# EAGLE design BPS6001 Arcade Shield (EAGLE 6.5.0)

## Sheet 1 of 6
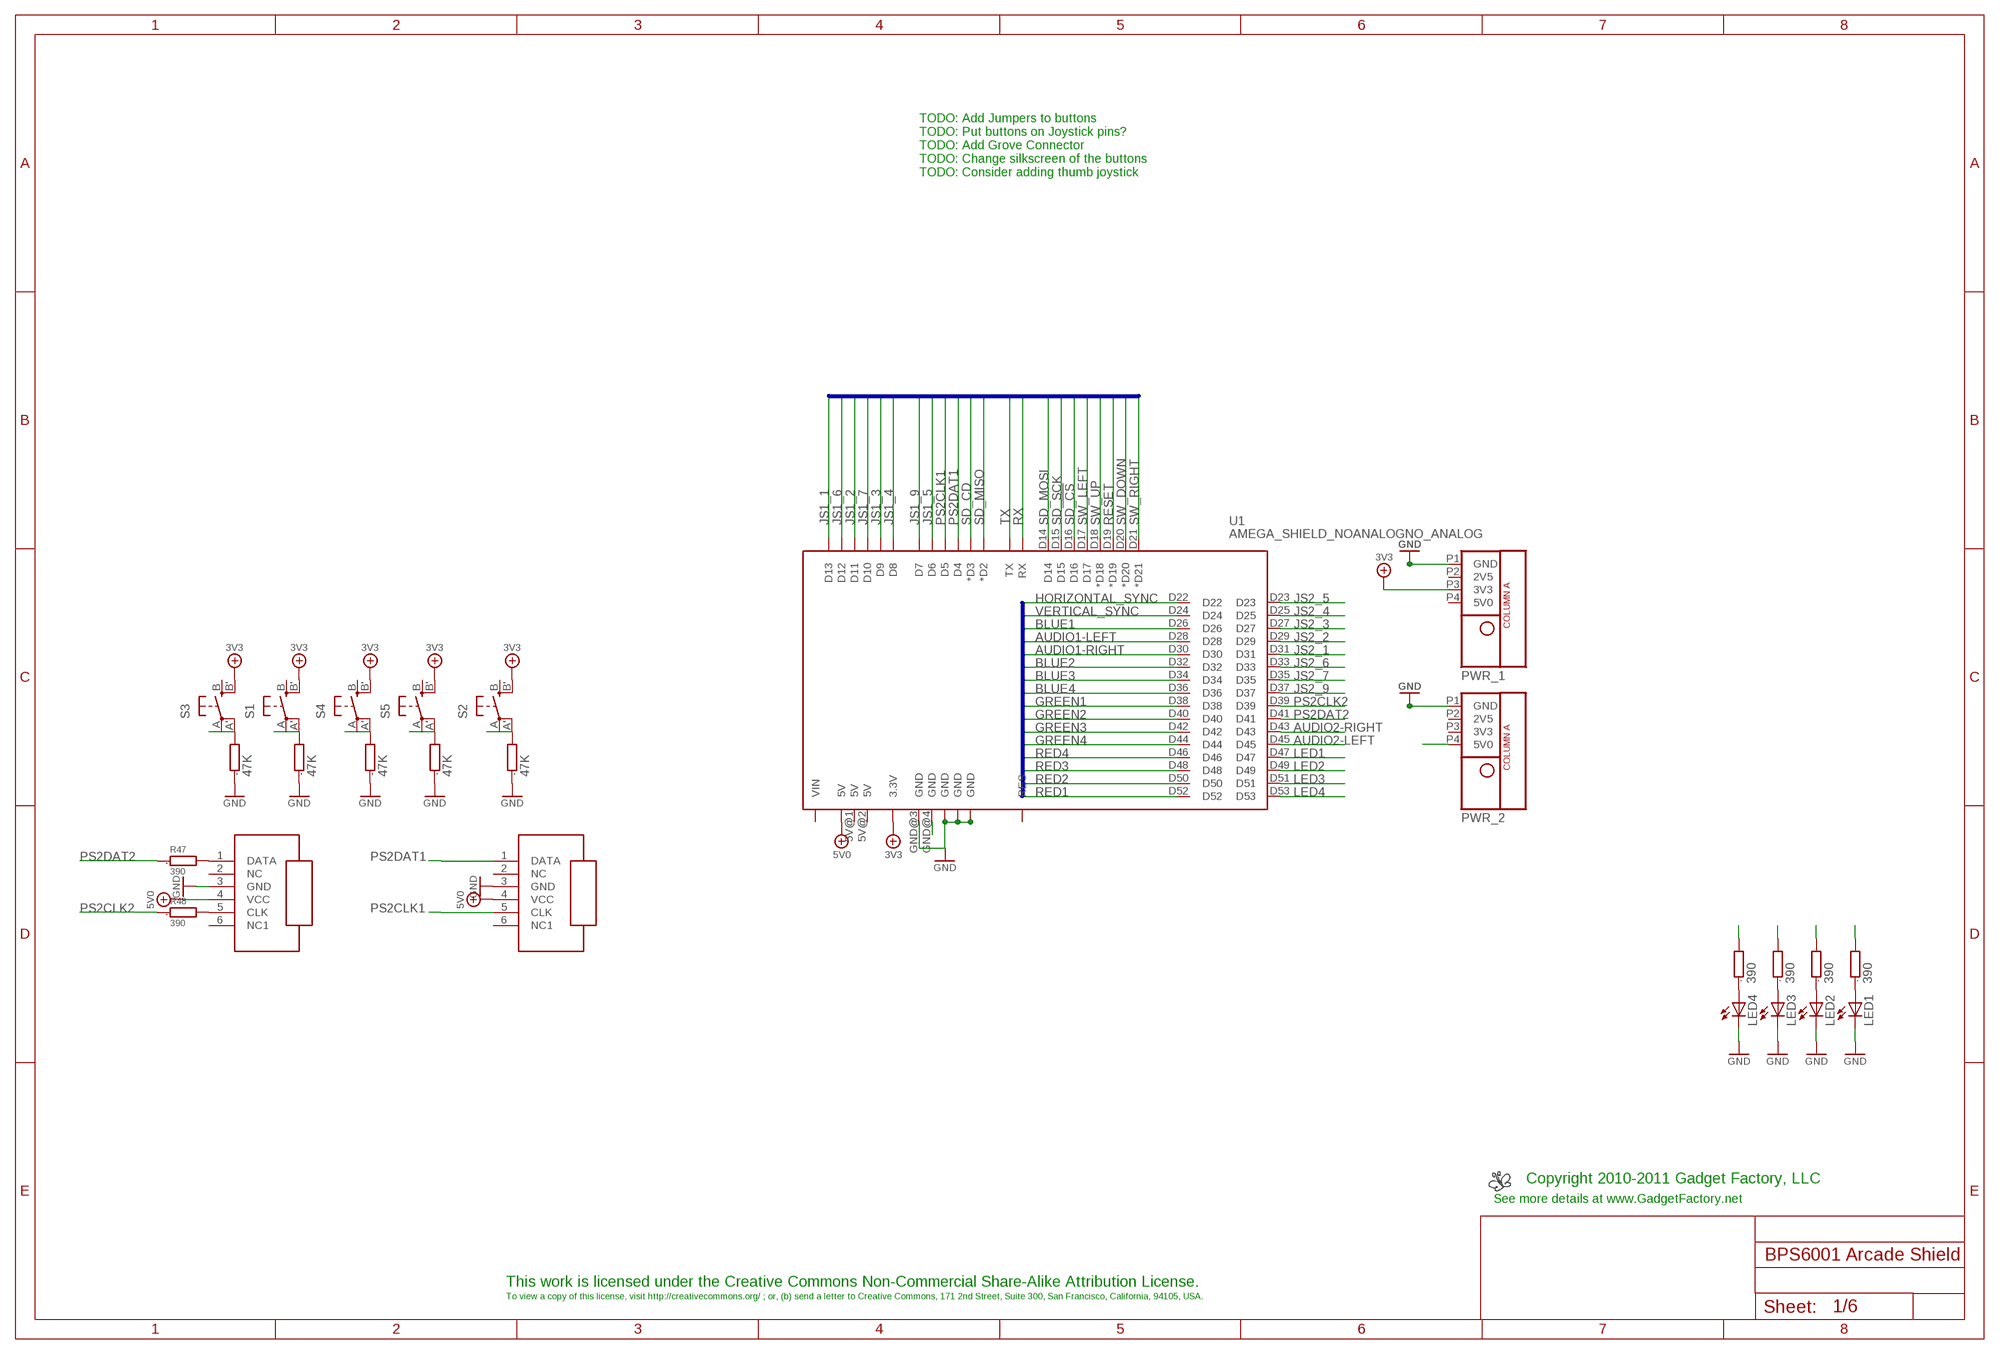
[diagram p0: schematic, sheet 1]

### Parts
LED1  LEDCHIPLED_0603  [CHIPLED_0603]
LED2  LEDCHIPLED_0603  [CHIPLED_0603]
LED3  LEDCHIPLED_0603  [CHIPLED_0603]
LED4  LEDCHIPLED_0603  [CHIPLED_0603]
LOGO1  BUTTERFLY_LOGO  [BUTTERFLY_LOGO]
PS2_A  CON_PS/2  [PS/2]
PS2_B  CON_PS/2  [PS/2]
PWR_1  POWER_ONLYNOTEXT  [POWER_NO_TEXT]
PWR_2  POWER_ONLYNOTEXT  [POWER_NO_TEXT]
R9  47K  R0603  [0603]
R10  47K  R0603  [0603]
R11  47K  R0603  [0603]
R17  47K  R0603  [0603]
R18  47K  R0603  [0603]
R26  390  R0603  [0603]
R27  390  R0603  [0603]
R43  390  R0603  [0603]
R44  390  R0603  [0603]
R47  390  R0603  [0603]
R48  390  R0603  [0603]
S1  EVQQ2  [EVQ-Q2]
S2  EVQQ2  [EVQ-Q2]
S3  EVQQ2  [EVQ-Q2]
S4  EVQQ2  [EVQ-Q2]
S5  EVQQ2  [EVQ-Q2]
U1  AMEGA_SHIELD_NOANALOGNO_ANALOG  [AMEGA_SHIELD_NOANALOG]

### Nets
3V3: S1.B'(S1) S2.B'(S1) S3.B'(S1) S4.B'(S1) S5.B'(S1) U1.3.3V ; also sheet 2,3,5
5V0: PS2_A.4(VCC) U1.5V@0(5V)
5V0_PS2: PS2_B.4(VCC) PWR_2.P4(5V0) ; supply symbol labelled 5V0
AUDIO1-LEFT: U1.D28 ; also sheet 4
AUDIO1-RIGHT: U1.D30 ; also sheet 4
AUDIO2-LEFT: U1.D45 ; also sheet 4
AUDIO2-RIGHT: U1.D43 ; also sheet 4
BLUE1: U1.D26 ; also sheet 6
BLUE2: U1.D32 ; also sheet 6
BLUE3: U1.D34 ; also sheet 6
BLUE4: U1.D36 ; also sheet 6
GND: PS2_A.3(GND) R9.1 R10.1 R11.1 R17.1 R18.1 U1.GND@0(GND) U1.GND@1(GND) U1.GND@2(GND) U1.GND@3(GND) ; also sheet 2,3,4,5,6
GREEN1: U1.D38 ; also sheet 6
GREEN2: U1.D40 ; also sheet 6
GREEN3: U1.D42 ; also sheet 6
GREEN4: U1.D44 ; also sheet 6
HORIZONTAL_SYNC: U1.D22 ; also sheet 6
JOY_3V3: PWR_1.P3(3V3) ; supply symbol labelled 3V3 ; also sheet 3
JOY_GND: LED1.C LED2.C LED3.C LED4.C PS2_B.3(GND) PWR_1.P1(GND) PWR_2.P1(GND) U1.GND@4(GND) ; supply symbol labelled GND ; also sheet 3,4
JS1_1: U1.D13 ; also sheet 3
JS1_2: U1.D11 ; also sheet 3
JS1_3: U1.D9 ; also sheet 3
JS1_4: U1.D8 ; also sheet 3
JS1_5: U1.D6 ; also sheet 3
JS1_6: U1.D12 ; also sheet 3
JS1_7: U1.D10 ; also sheet 3
JS1_9: U1.D7 ; also sheet 3
JS2_1: U1.D31 ; also sheet 3
JS2_2: U1.D29 ; also sheet 3
JS2_3: U1.D27 ; also sheet 3
JS2_4: U1.D25 ; also sheet 3
JS2_5: U1.D23 ; also sheet 3
JS2_6: U1.D33 ; also sheet 3
JS2_7: U1.D35 ; also sheet 3
JS2_9: U1.D37 ; also sheet 3
LED1: R26.2 U1.D47
LED2: R27.2 U1.D49
LED3: R43.2 U1.D51
LED4: R44.2 U1.D53
N$3: LED4.A R44.1
N$9: LED3.A R43.1
N$10: LED2.A R27.1
N$11: LED1.A R26.1
N$16: PS2_B.1(DATA) R47.2
N$17: PS2_B.5(CLK) R48.2
PS2CLK1: PS2_A.5(CLK) U1.D5
PS2CLK2: R48.1 U1.D39
PS2DAT1: PS2_A.1(DATA) U1.D4
PS2DAT2: R47.1 U1.D41
RED1: U1.D52 ; also sheet 6
RED2: U1.D50 ; also sheet 6
RED3: U1.D48 ; also sheet 6
RED4: U1.D46 ; also sheet 6
RESET: R11.2 S2.A'(P1) S2.A(P) U1.D19(*D19)
RX: U1.RX ; also sheet 5
SD_!CS: U1.D16 ; also sheet 2
SD_CD: U1.D3(*D3) ; also sheet 2
SD_MISO: U1.D2(*D2) ; also sheet 2
SD_MOSI: U1.D14 ; also sheet 2
SD_SCK: U1.D15 ; also sheet 2
SW_DOWN: R17.2 S4.A'(P1) S4.A(P) U1.D20(*D20)
SW_LEFT: R9.2 S3.A'(P1) S3.A(P) U1.D17
SW_RIGHT: R18.2 S5.A'(P1) S5.A(P) U1.D21(*D21)
SW_UP: R10.2 S1.A'(P1) S1.A(P) U1.D18(*D18)
TX: U1.TX ; also sheet 5
VERTICAL_SYNC: U1.D24 ; also sheet 6
Unconnected: PS2_A.2(NC) PS2_A.6(NC1) PS2_B.2(NC) PS2_B.6(NC1) PWR_1.P2(2V5) PWR_1.P4(5V0) PWR_2.P2(2V5) PWR_2.P3(3V3) S1.B(S) S2.B(S) S3.B(S) S4.B(S) S5.B(S) U1.5V@1(5V) U1.5V@2(5V) U1.RES U1.VIN

### Buses
LED[1..4],JS1_[1..9],JS2_[1..9],AUDIO-,AUDIO+,PS2CLK1,PS2CLK2,PS2DAT1,PS2DAT2,RED[1..4],GREEN[1..4],BLUE[1..4],SW[1..4],RESET,HORIZONTAL_SYNC

### Notes on the sheet
- TODO: Add Jumpers to buttons
  TODO: Put buttons on Joystick pins?
  TODO: Add Grove Connector
  TODO: Change silkscreen of the buttons
  TODO: Consider adding thumb joystick
- Copyright 2010-2011 Gadget Factory, LLC
- See more details at www.GadgetFactory.net
- This work is licensed under the Creative Commons Non-Commercial Share-Alike Attribution License.
- To view a copy of this license, visit http://creativecommons.org/ ; or, (b) send a letter to Creative Commons, 171 2nd Street, Suite 300, San Francisco, California, 94105, USA.

## Sheet 2 of 6: SD Card
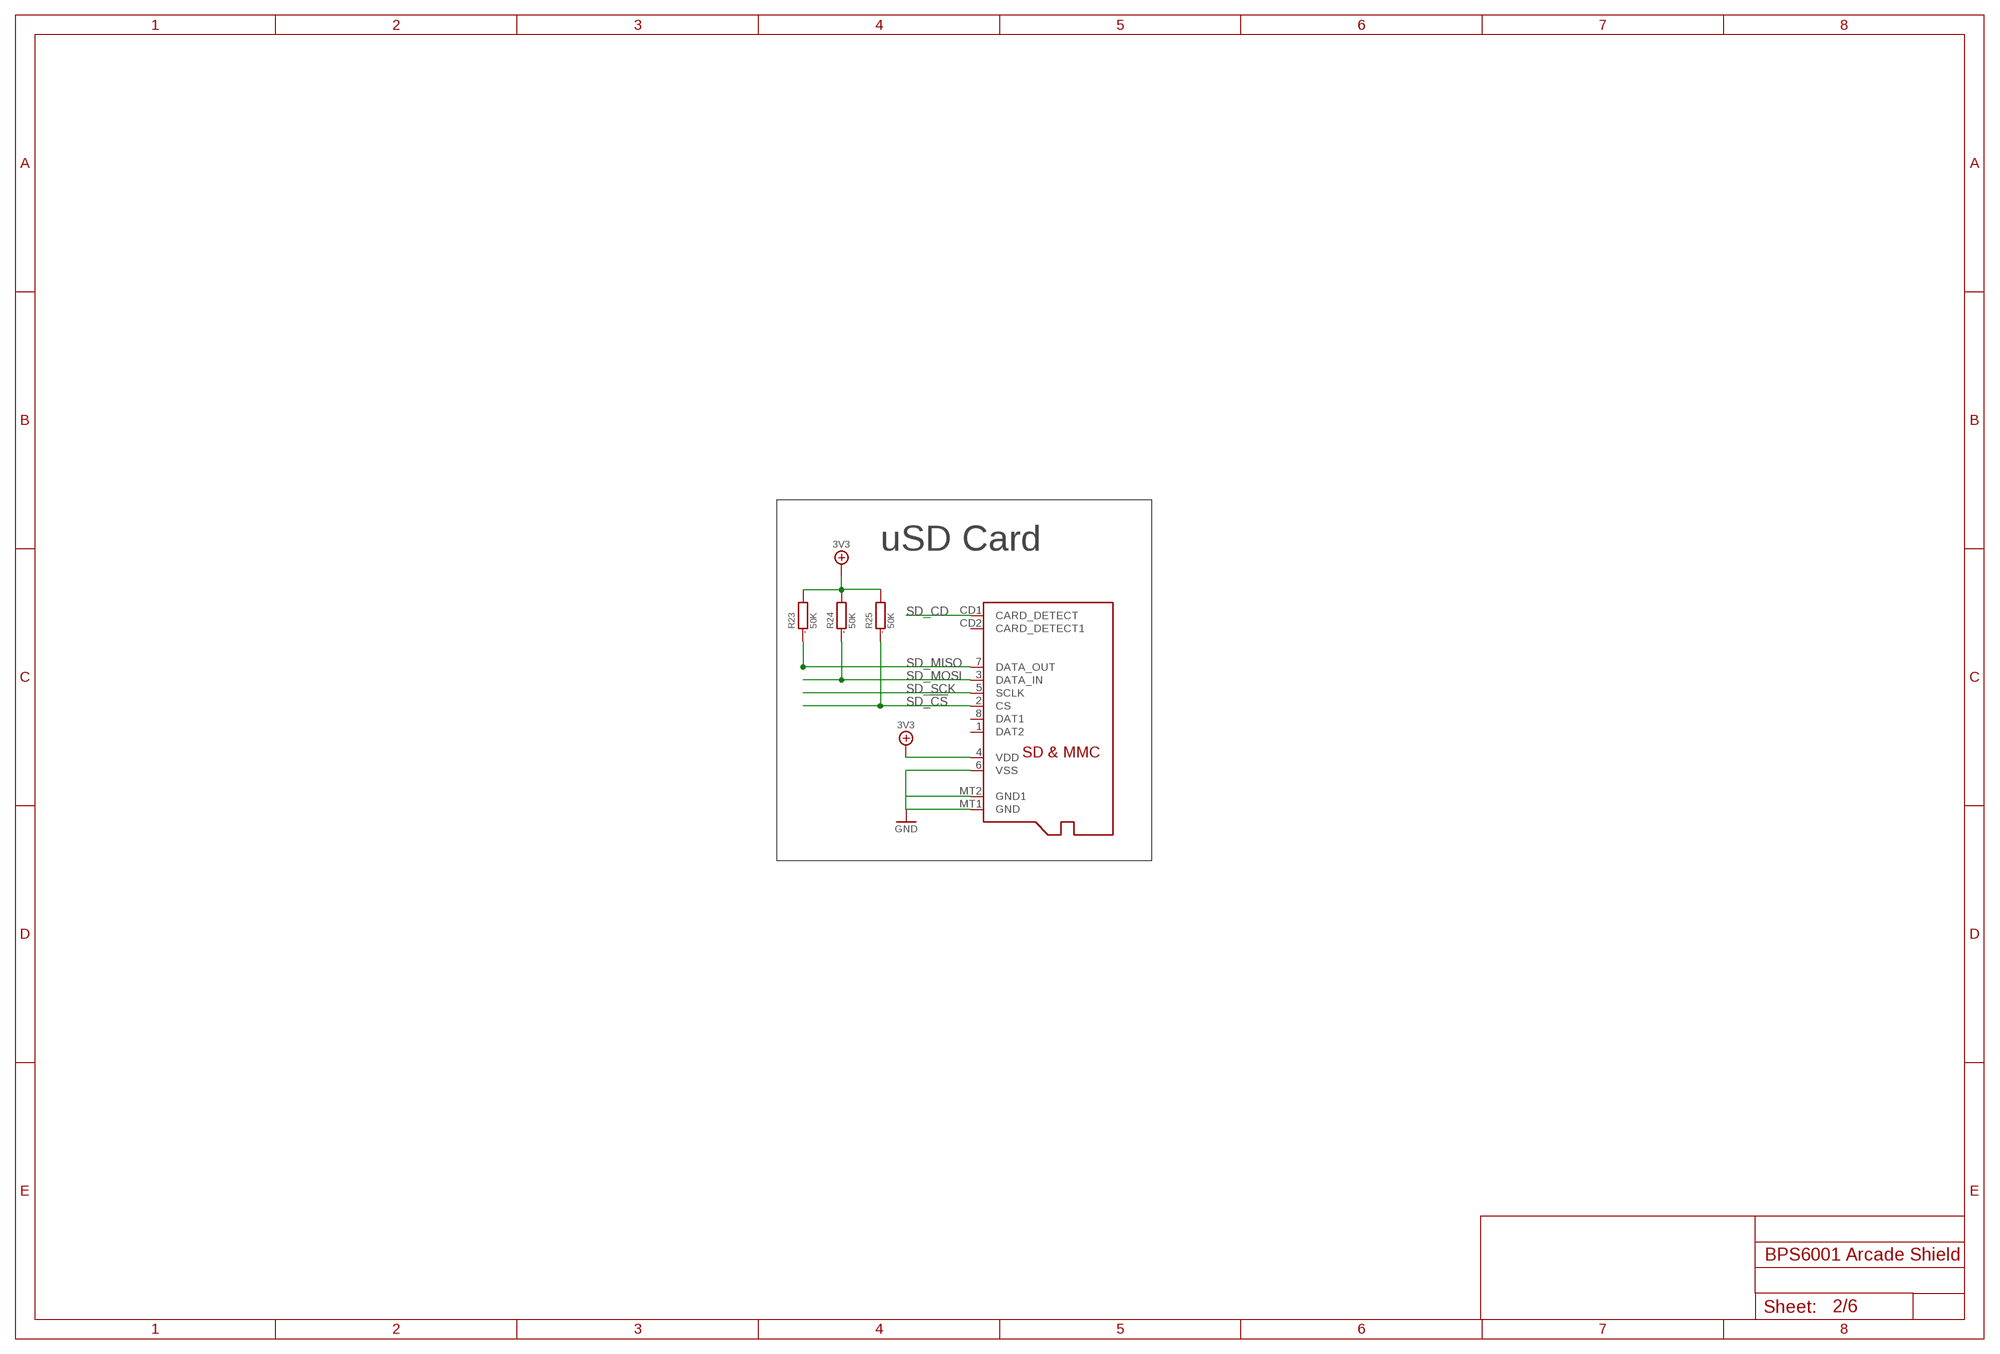
[diagram p1: schematic, sheet 2]

### Parts
R23  50K  R0805  [0805]
R24  50K  R0805  [0805]
R25  50K  R0805  [0805]
SD1  MICROSD  [MICROSD]

### Nets
3V3: R23.2 R24.2 R25.2 SD1.4(VDD) ; also sheet 1,3,5
GND: SD1.6(VSS) SD1.MT1(GND) SD1.MT2(GND1) ; also sheet 1,3,4,5,6
SD_!CS: R25.1 SD1.2(CS) ; also sheet 1
SD_CD: SD1.CD1(CARD_DETECT) ; also sheet 1
SD_MISO: R23.1 SD1.7(DATA_OUT) ; also sheet 1
SD_MOSI: R24.1 SD1.3(DATA_IN) ; also sheet 1
SD_SCK: SD1.5(SCLK) ; also sheet 1
Unconnected: SD1.1(DAT2) SD1.8(DAT1) SD1.CD2(CARD_DETECT1)

### Notes on the sheet
- uSD Card

## Sheet 3 of 6: Joysticks
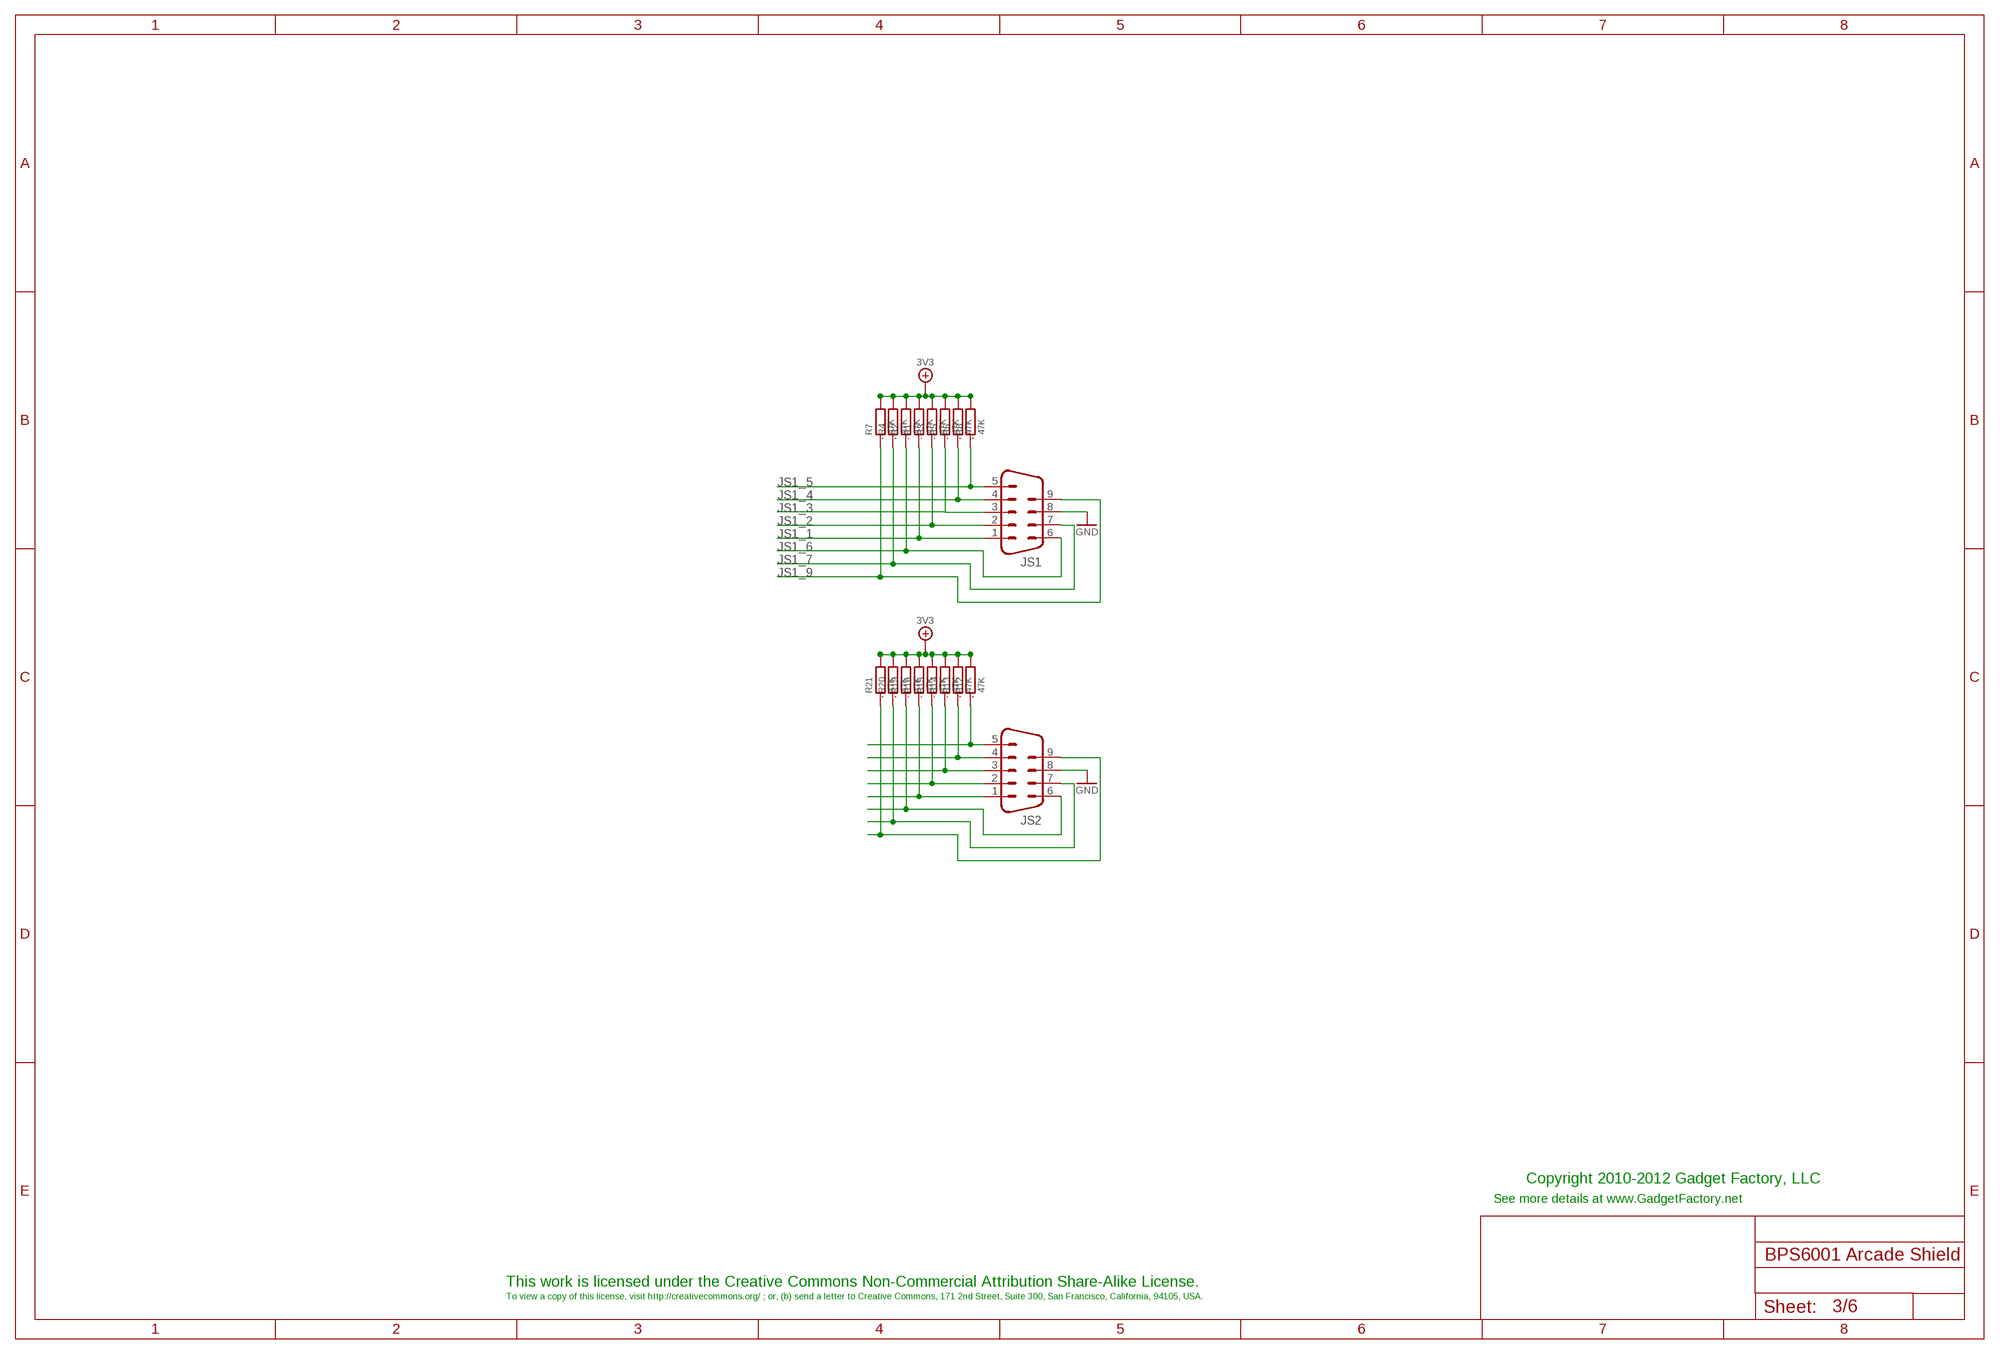
[diagram p2: schematic, sheet 3]

### Parts
JS1  M09HP  [M09HP]
JS2  M09HP  [M09HP]
R1  47K  R0603  [0603]
R2  47K  R0603  [0603]
R3  47K  R0603  [0603]
R4  47K  R0603  [0603]
R5  47K  R0603  [0603]
R6  47K  R0603  [0603]
R7  47K  R0603  [0603]
R8  47K  R0603  [0603]
R12  47K  R0603  [0603]
R13  47K  R0603  [0603]
R14  47K  R0603  [0603]
R15  47K  R0603  [0603]
R16  47K  R0603  [0603]
R19  47K  R0603  [0603]
R20  47K  R0603  [0603]
R21  47K  R0603  [0603]

### Nets
3V3: R1.2 R2.2 R3.2 R4.2 R5.2 R6.2 R7.2 R8.2 ; also sheet 1,2,5
GND: JS1.8 ; also sheet 1,2,4,5,6
JOY_3V3: R12.2 R13.2 R14.2 R15.2 R16.2 R19.2 R20.2 R21.2 ; also sheet 1
JOY_GND: JS2.8 ; supply symbol labelled GND ; also sheet 1,4
JS1_1: JS1.1 R1.1 ; also sheet 1
JS1_2: JS1.2 R3.1 ; also sheet 1
JS1_3: JS1.3 R5.1 ; also sheet 1
JS1_4: JS1.4 R6.1 ; also sheet 1
JS1_5: JS1.5 R8.1 ; also sheet 1
JS1_6: JS1.6 R2.1 ; also sheet 1
JS1_7: JS1.7 R4.1 ; also sheet 1
JS1_9: JS1.9 R7.1 ; also sheet 1
JS2_1: JS2.1 R16.1 ; also sheet 1
JS2_2: JS2.2 R15.1 ; also sheet 1
JS2_3: JS2.3 R14.1 ; also sheet 1
JS2_4: JS2.4 R13.1 ; also sheet 1
JS2_5: JS2.5 R12.1 ; also sheet 1
JS2_6: JS2.6 R19.1 ; also sheet 1
JS2_7: JS2.7 R20.1 ; also sheet 1
JS2_9: JS2.9 R21.1 ; also sheet 1

### Notes on the sheet
- Copyright 2010-2012 Gadget Factory, LLC
- See more details at www.GadgetFactory.net
- This work is licensed under the Creative Commons Non-Commercial Attribution Share-Alike License.
- To view a copy of this license, visit http://creativecommons.org/ ; or, (b) send a letter to Creative Commons, 171 2nd Street, Suite 300, San Francisco, California, 94105, USA.

## Sheet 4 of 6: Audio
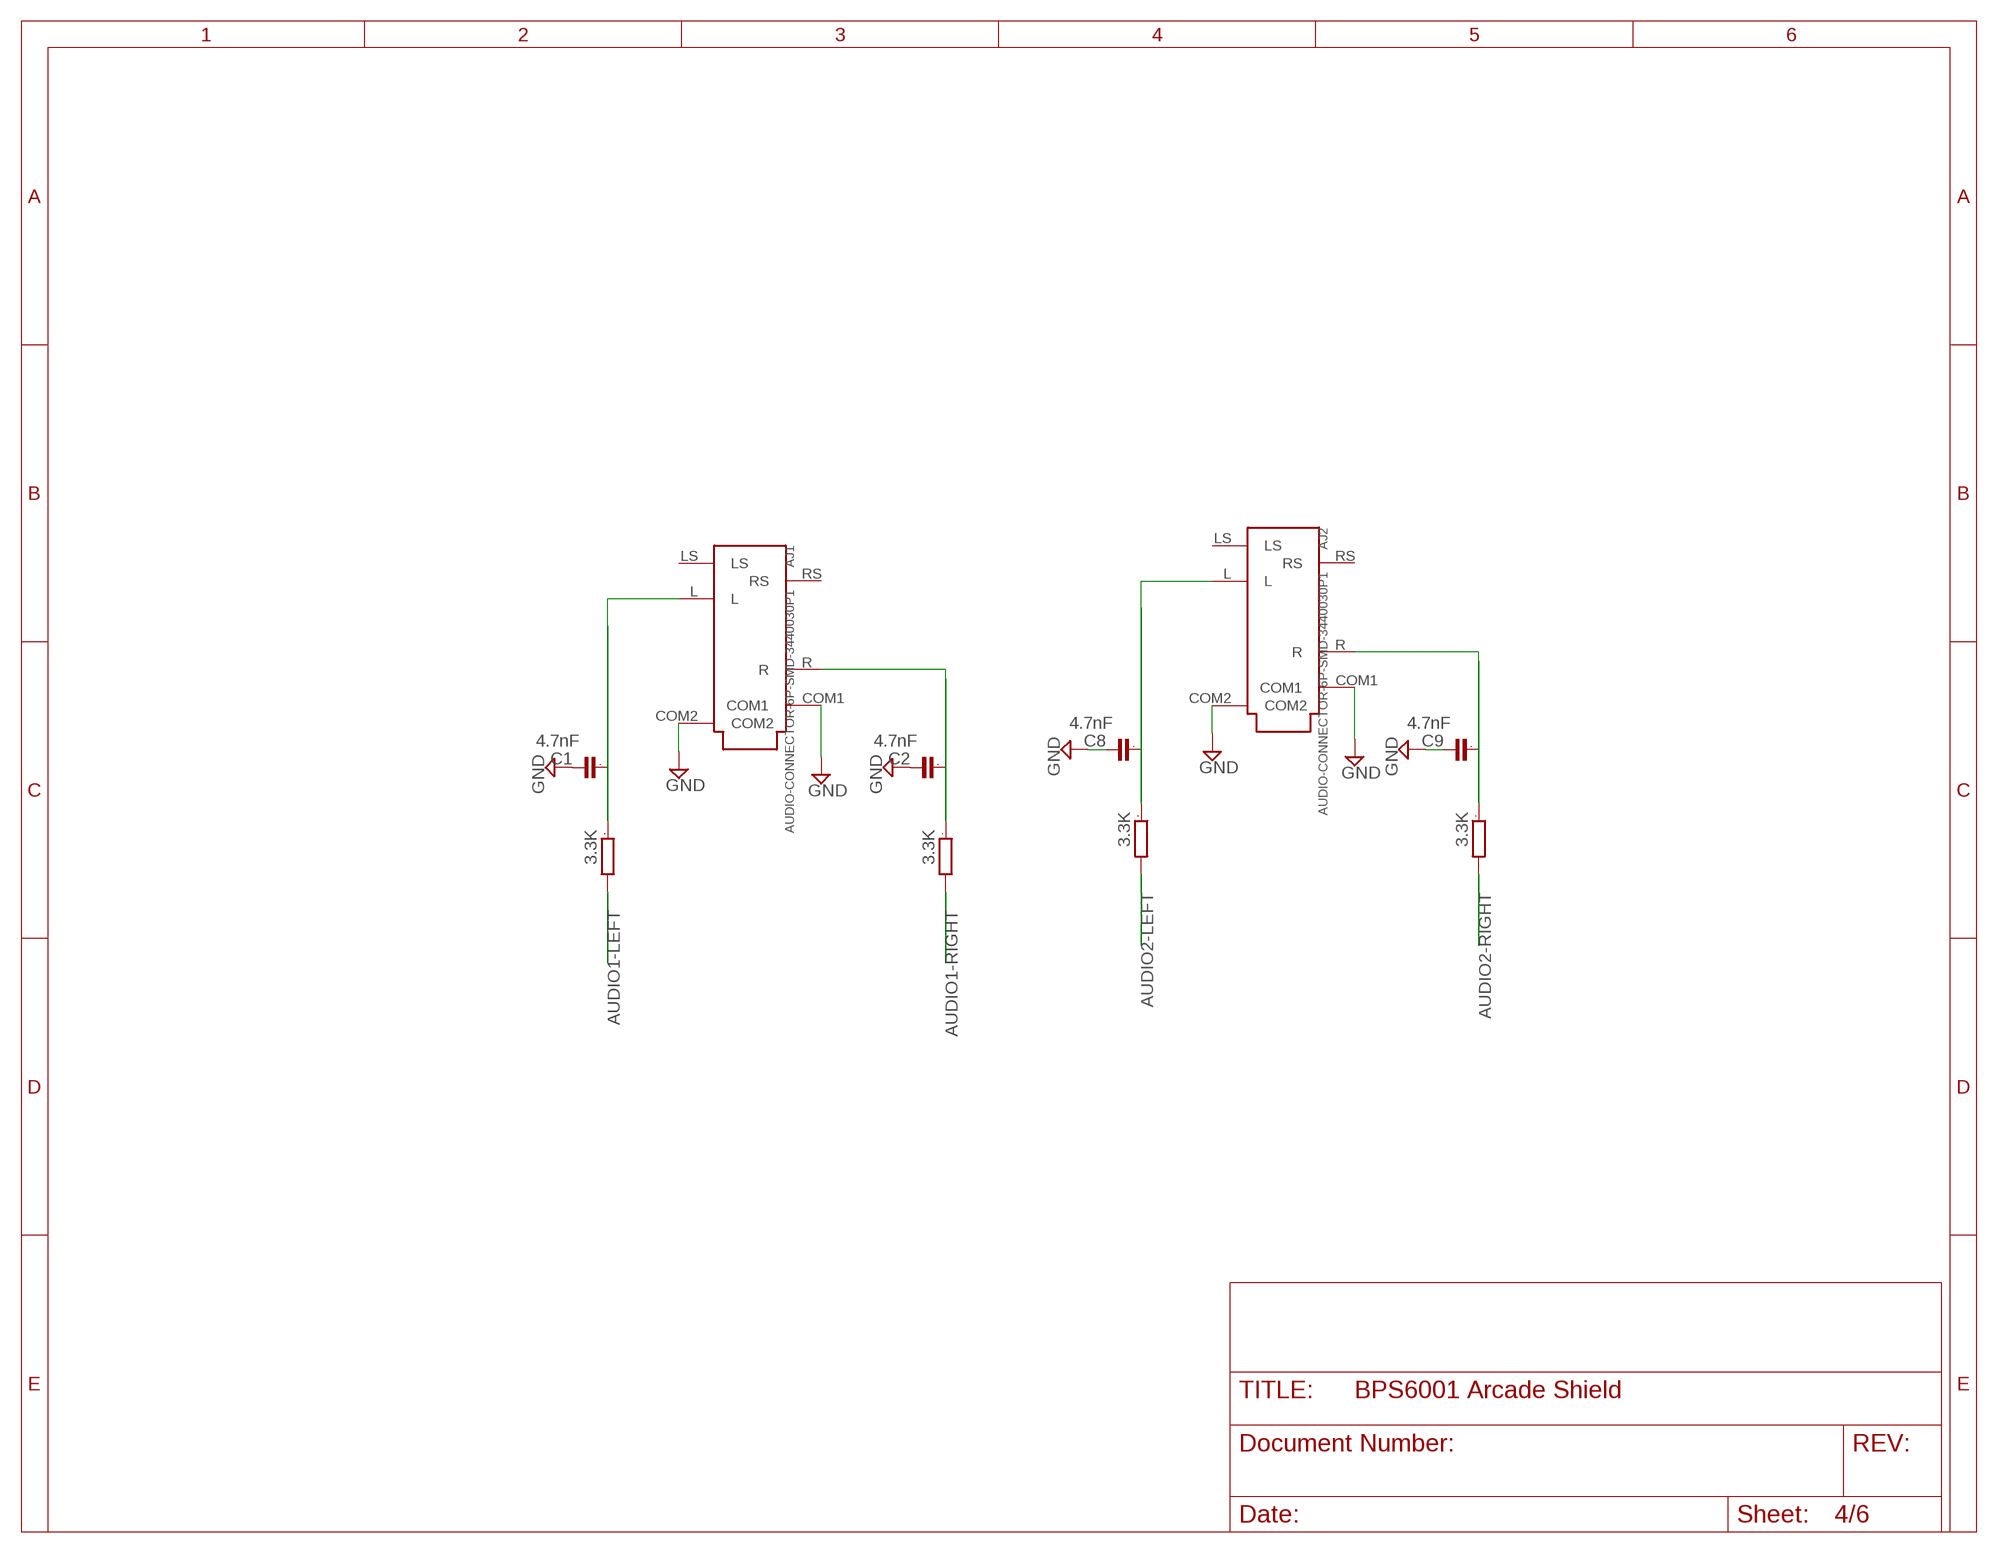
[diagram p3: schematic, sheet 4]

### Parts
AJ1  AUDIO-CONNECTOR-6P-SMD-3440030P1  [6P-SMD-3.5]
AJ2  AUDIO-CONNECTOR-6P-SMD-3440030P1  [6P-SMD-3.5]
C1  4.7nF  C0603  [0603]
C2  4.7nF  C0603  [0603]
C8  4.7nF  C0603  [0603]
C9  4.7nF  C0603  [0603]
R22  3.3K  R0603  [0603]
R28  3.3K  R0603  [0603]
R45  3.3K  R0603  [0603]
R46  3.3K  R0603  [0603]

### Nets
AUDIO1-LEFT: R22.2 ; also sheet 1
AUDIO1-RIGHT: R28.2 ; also sheet 1
AUDIO2-LEFT: R45.2 ; also sheet 1
AUDIO2-RIGHT: R46.2 ; also sheet 1
GND: AJ1.COM1 AJ1.COM2 C1.2 C2.2 ; also sheet 1,2,3,5,6
JOY_GND: AJ2.COM1 AJ2.COM2 C8.2 C9.2 ; supply symbol labelled GND ; also sheet 1,3
N$1: AJ2.L C8.1 R45.1
N$2: AJ1.L C1.1 R22.1
N$15: AJ2.R C9.1 R46.1
N$34: AJ1.R C2.1 R28.1
Unconnected: AJ1.LS AJ1.RS AJ2.LS AJ2.RS

## Sheet 5 of 6: RS232 UART
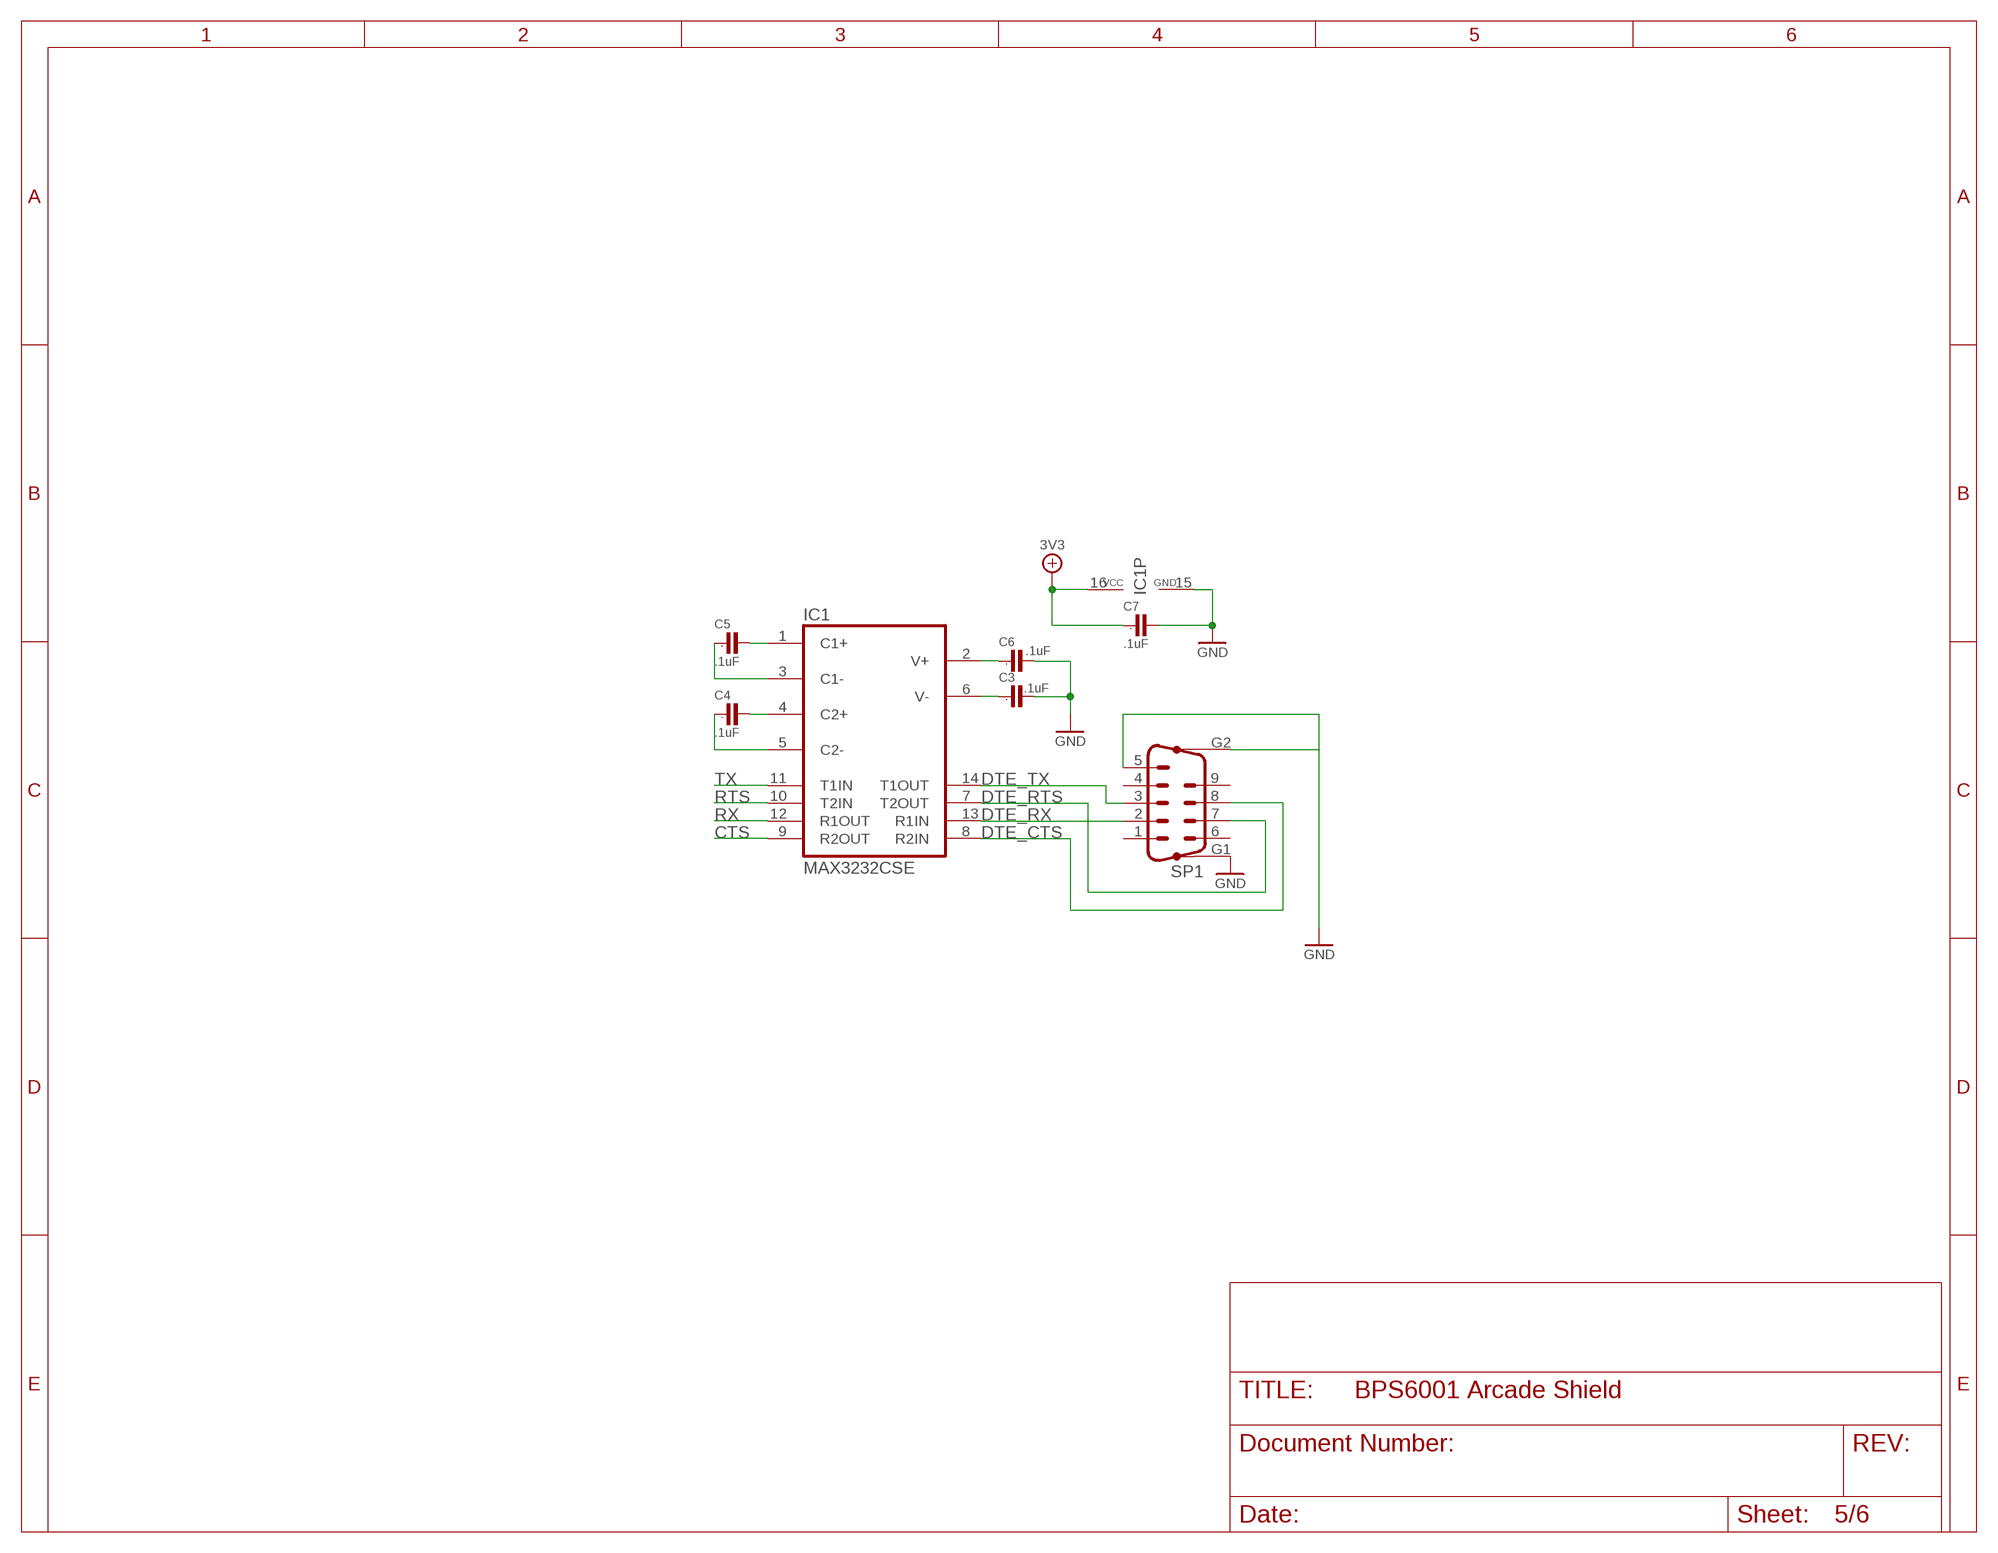
[diagram p4: schematic, sheet 5]

### Parts
C3  .1uF  C0805  [0805]
C4  .1uF  C0805  [0805]
C5  .1uF  C0805  [0805]
C6  .1uF  C0805  [0805]
C7  .1uF  C0805  [0805]
IC1  MAX3232CSE  [SO16]
SP1  M09HP  [M09HP]

### Nets
3V3: C7.1 IC1.16(VCC) ; also sheet 1,2,3
CTS: IC1.9(R2OUT)
DTE_CTS: IC1.8(R2IN) SP1.8
DTE_RTS: IC1.7(T2OUT) SP1.7
DTE_RX: IC1.13(R1IN) SP1.2
DTE_TX: IC1.14(T1OUT) SP1.3
GND: C3.2 C6.2 C7.2 IC1.15(GND) SP1.5 SP1.G1 SP1.G2 ; also sheet 1,2,3,4,6
N$6: C6.1 IC1.2(V+)
N$7: C3.1 IC1.6(V-)
N$8: C5.2 IC1.1(C1+)
N$12: C4.2 IC1.4(C2+)
N$13: C5.1 IC1.3(C1-)
N$14: C4.1 IC1.5(C2-)
RTS: IC1.10(T2IN)
RX: IC1.12(R1OUT) ; also sheet 1
TX: IC1.11(T1IN) ; also sheet 1
Unconnected: SP1.1 SP1.4 SP1.6 SP1.9

## Sheet 6 of 6: 4096 VGA
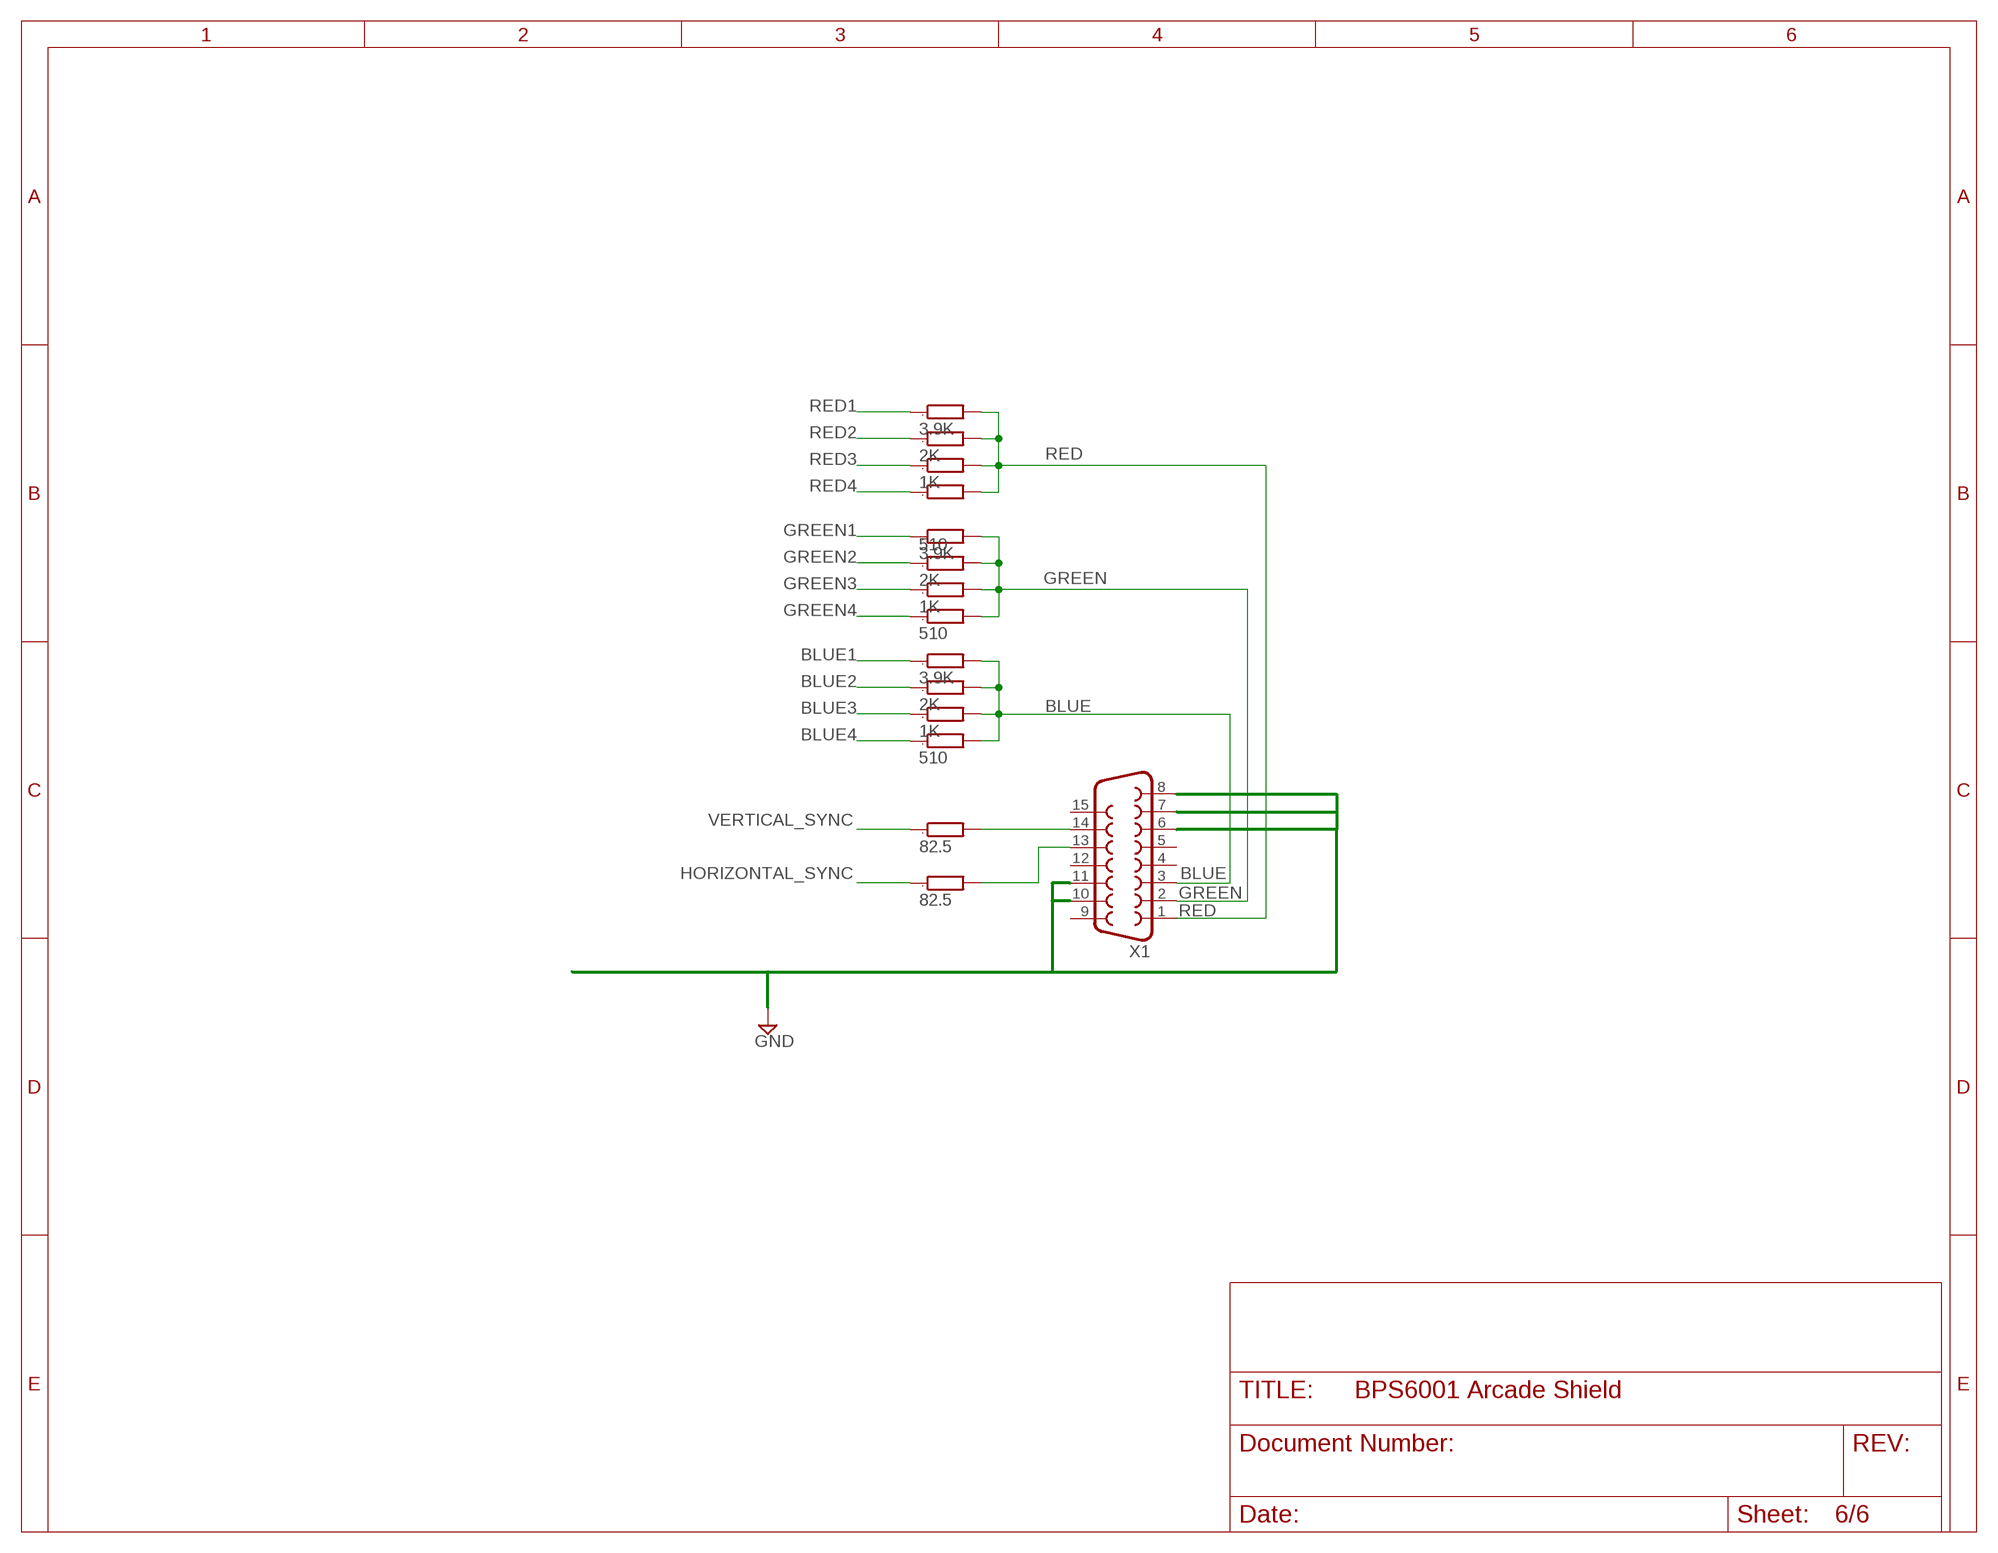
[diagram p5: schematic, sheet 6]

### Parts
R29  82.5  R0603  [0603]
R30  82.5  R0603  [0603]
R31  3.9K  R0603  [0603]
R32  2K  R0603  [0603]
R33  1K  R0603  [0603]
R34  510  R0603  [0603]
R35  3.9K  R0603  [0603]
R36  2K  R0603  [0603]
R37  1K  R0603  [0603]
R38  510  R0603  [0603]
R39  510  R0603  [0603]
R40  1K  R0603  [0603]
R41  2K  R0603  [0603]
R42  3.9K  R0603  [0603]
X1  F15HDH  [HDF15H]

### Nets
BLUE: R31.2 R32.2 R33.2 R34.2 X1.3
BLUE1: R31.1 ; also sheet 1
BLUE2: R32.1 ; also sheet 1
BLUE3: R33.1 ; also sheet 1
BLUE4: R34.1 ; also sheet 1
GND: X1.6 X1.7 X1.8 X1.10 X1.11 ; also sheet 1,2,3,4,5
GREEN: R35.2 R36.2 R37.2 R38.2 X1.2
GREEN1: R35.1 ; also sheet 1
GREEN2: R36.1 ; also sheet 1
GREEN3: R37.1 ; also sheet 1
GREEN4: R38.1 ; also sheet 1
HORIZONTAL_SYNC: R29.1 ; also sheet 1
N$4: R29.2 X1.13
N$5: R30.2 X1.14
RED: R39.2 R40.2 R41.2 R42.2 X1.1
RED1: R42.1 ; also sheet 1
RED2: R41.1 ; also sheet 1
RED3: R40.1 ; also sheet 1
RED4: R39.1 ; also sheet 1
VERTICAL_SYNC: R30.1 ; also sheet 1
Unconnected: X1.4 X1.5 X1.9 X1.12 X1.15

## Library data of the parts
AJ1 AJ2 = OPL Eagle Library:AUDIO-CONNECTOR-6P-SMD: When you use the footprint ,place notice 46 (layer)milling ,there is some important information.
C1 C2 C8 C9 = GadgetFactory:C: CAPACITOR, European symbol
C3-C7 = GadgetFactory_6.0:C: CAPACITOR, European symbol
IC1 = maxim:MAX3232*: True RS-232 Transceivers 3.0V to 5.5V, Low-Power up to 1Mbps, Using Four 0.1µF External Capacitors Source: http://pdfserv.maxim-ic.com/en/ds/MAX3222-MAX3241.pdf; MPN: MAX3232CSE; OC_FARNELL: 9725490; OC_NEWARK: 90C2890
JS1 JS2 = con-subd:M09: SUB-D
LED1-LED4 = led:LED: LED OSRAM: - CHIPLED LG R971, LG N971, LY N971, LG Q971, LY Q971, LO R971, LY R971 LH N974, LH R974 LS Q976, LO Q976, LY Q976 LO Q996 - Hyper CHIPLED LW Q18S LB Q993, LB Q99A, LB R99A - SideLED LS A670, LO A670, LY A670, LG A670, LP A670 LB A673, LV A673, LT A673, LW A673 LH A674 LY A675 LS A676, LA A676, LO A676, LY A676, LW A676 LS A679, LY A679, LG A679 - Hyper Micro SIDELED® LS Y876, LA Y876, LO Y876, LY Y876 LT Y87S - SmartLED LW L88C, LW L88S LB L89C, LB L89S, LG L890 LS L89K, LO L89K, LY L89K LS L896, LA L896, LO L896, LY L896 - TOPLED LS T670, LO T670, LY T670, LG T670, LP T670 LSG T670, LSP T670, LSY T670, LOP T670, LYG T670 LG T671, LOG T671, LSG T671 LB T673, LV T673, LT T673, LW T673 LH T674 LS T676, LA T676, LO T676, LY T676, LB T676, LH T676, LSB T676, LW T676 LB T67C, LV T67C, LT T67C, LS T67K, LO T67K, LY T67K, LW E67C LS E67B, LA E67B, LO E67B, LY E67B, LB E67C, LV E67C, LT E67C LW T67C LS T679, LY T679, LG T679 LS T770, LO T770, LY T770, LG T770, LP T770 LB T773, LV T773, LT T773, LW T773 LH T774 LS E675, LA E675, LY E675, LS T675 LS T776, LA T776, LO T776, LY T776, LB T776 LHGB T686 LT T68C, LB T68C - Hyper Mini TOPLED® LB M676 - Mini TOPLED Santana® LG M470 LS M47K, LO M47K, LY M47K Source: http://www.osram.convergy.de LUXEON: - LUMILED® LXK2-PW12-R00, LXK2-PW12-S00, LXK2-PW14-U00, LXK2-PW14-V00 LXK2-PM12-R00, LXK2-PM12-S00, LXK2-PM14-U00 LXK2-PE12-Q00, LXK2-PE12-R00, LXK2-PE12-S00, LXK2-PE14-T00, LXK2-PE14-U00 LXK2-PB12-K00, LXK2-PB12-L00, LXK2-PB12-M00, LXK2-PB14-N00, LXK2-PB14-P00, LXK2-PB14-Q00 LXK2-PR12-L00, LXK2-PR12-M00, LXK2-PR14-Q00, LXK2-PR14-R00 LXK2-PD12-Q00, LXK2-PD12-R00, LXK2-PD12-S00 LXK2-PH12-R00, LXK2-PH12-S00 LXK2-PL12-P00, LXK2-PL12-Q00, LXK2-PL12-R00 Source: www.luxeon.com KINGBRIGHT: KA-3528ASYC Source: www.kingbright.com
LOGO1 = GadgetFactory_Pub:BUTTERFLY_LOGO
PS2_A PS2_B = usb1:CON_PS/2
PWR_1 PWR_2 = Papilio:POWER_ONLY
R1-R22 R26-R46 = GadgetFactory:R: RESISTOR, European symbol
R23-R25 R47 R48 = GadgetFactory_6.0:R: RESISTOR, European symbol
S1-S5 = adafruit:EVQQ2: SMT 6mm switch, EVQQ2 series http://www.ladyada.net/library/eagle
SD1 = adafruit:MICROSD: Micro-SD / Transflash card holder with SPI pinout For the 3M # 2908-05WB-MG and/or 4UCON #19656 push-push type
SP1 = con-subd:M09HP: SUB-D; OC_FARNELL: unknown; OC_NEWARK: unknown
U1 = Papilio:AMEGA_SHIELD_NOANALOG
X1 = GadgetFactory_6.0:F15: SUB-D; OC_FARNELL: unknown; OC_NEWARK: unknown

## Board
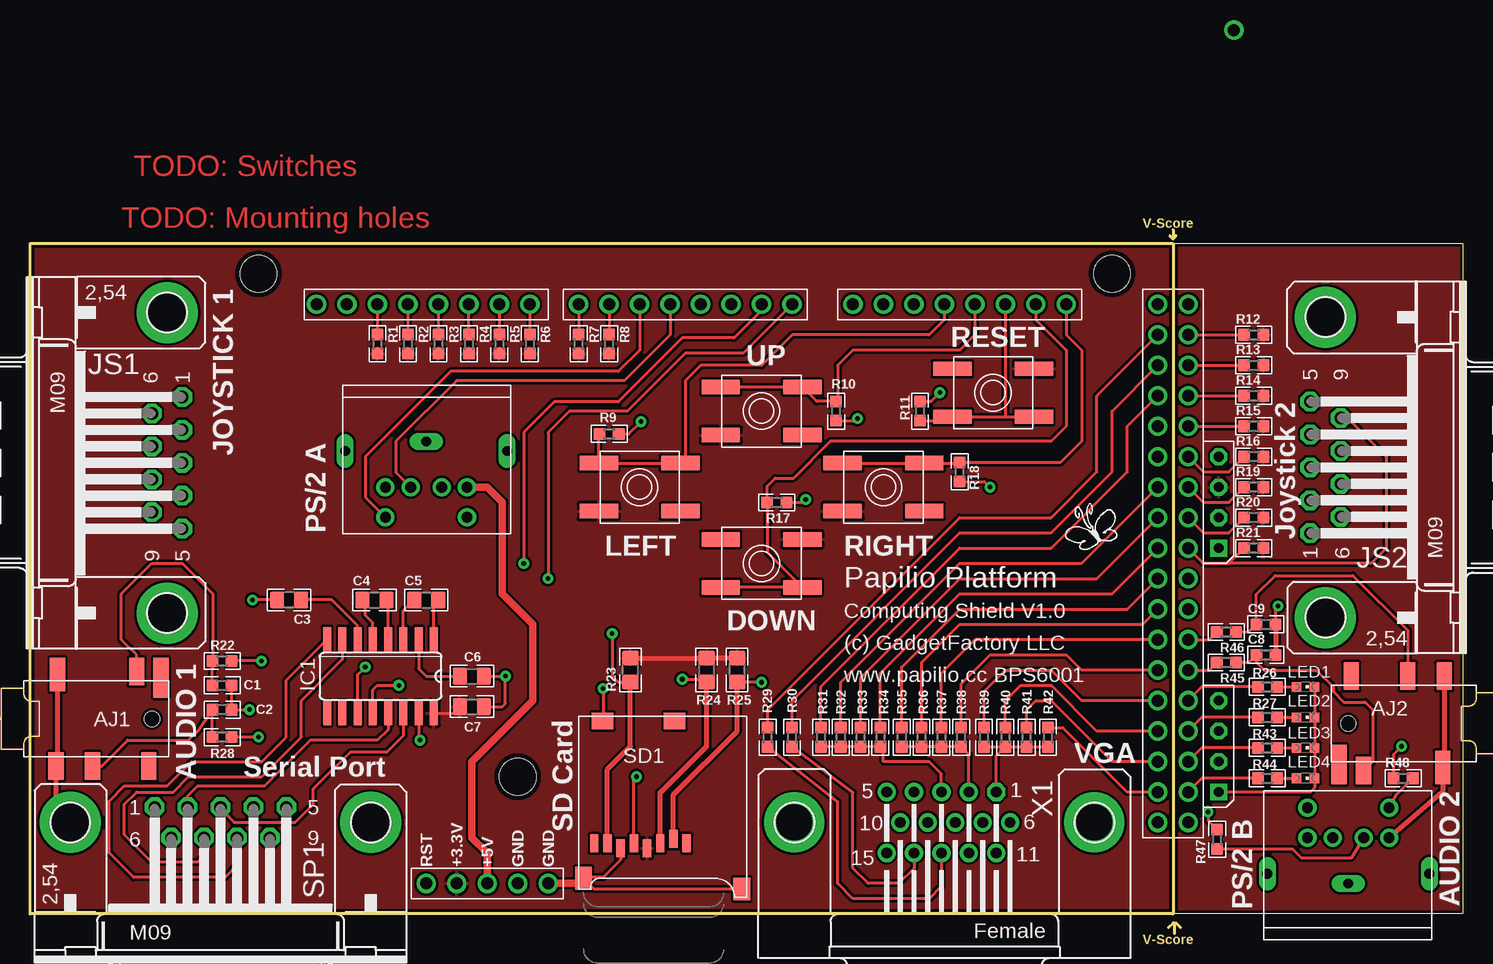
[diagram p6: board, top side]
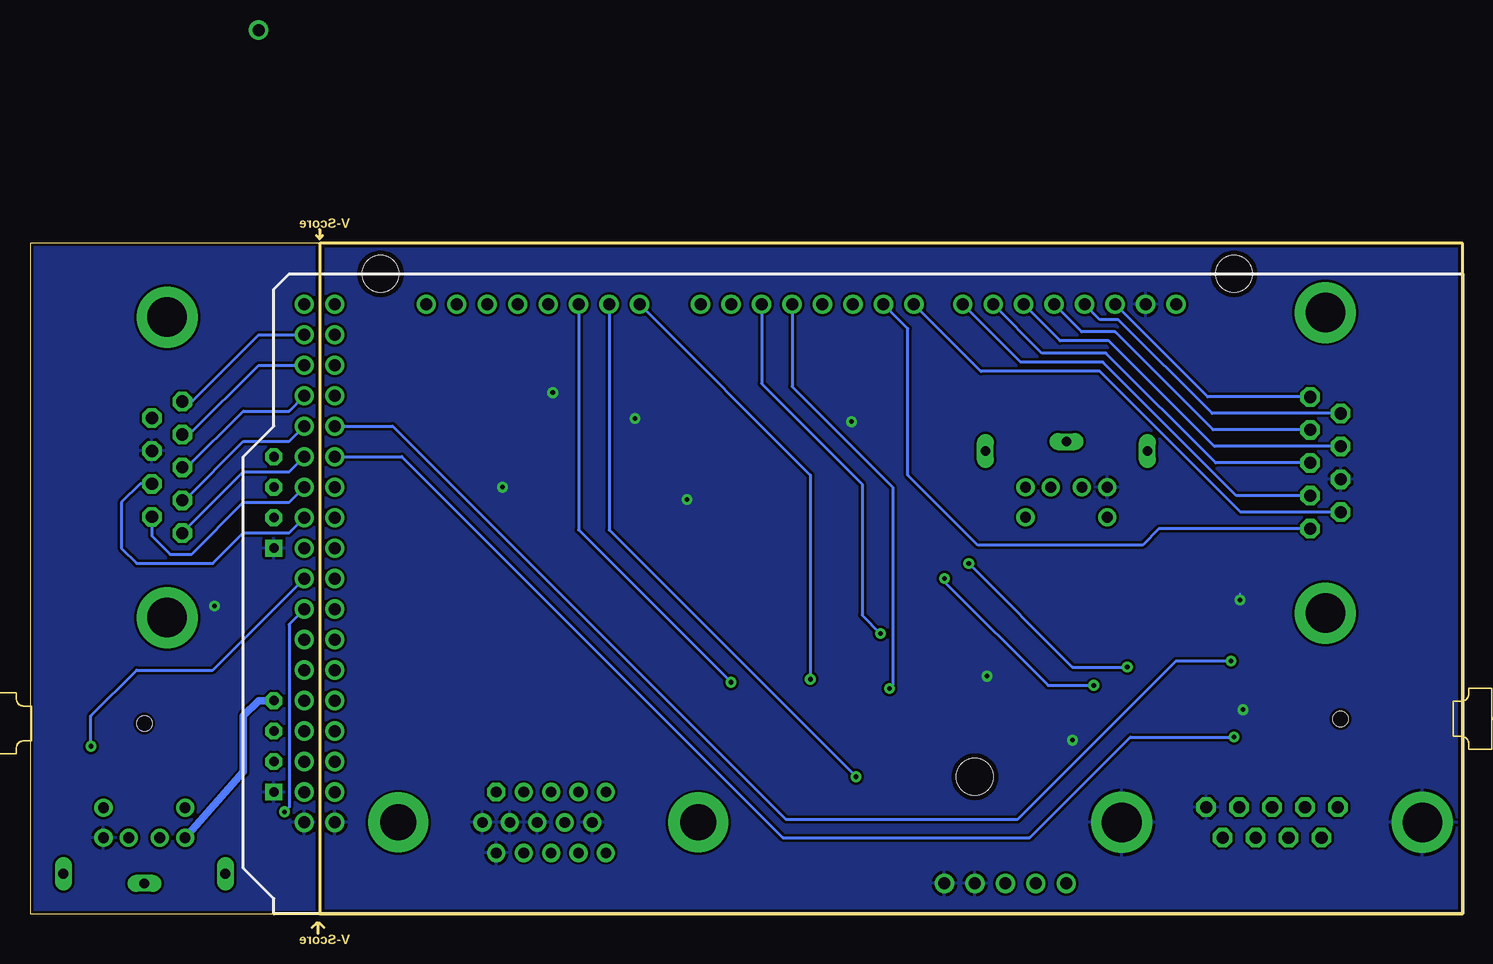
[diagram p7: board, bottom side, seen from below]

Size 119.38 x 58.67 mm. Coordinates in mm from the lower left corner, seen from the top.
Outline: 95.25,57.53 0,57.53 0,1.65 95.25,1.65
Outline: 95.25,57.53 95.25,1.65
Outline: 95.25,57.53 119.38,57.53 119.38,1.65 95.25,1.65
Outline: 95.38,0 95.38,0.89
Outline: 95.38,0.89 95.25,0.89 94.87,0.51
Outline: 95.38,0.89 95.5,0.89 95.89,0.51
Outline: 95.25,58.67 95.25,57.91
Outline: 95.25,57.91 95.5,58.17
Outline: 95.25,57.91 95,58.17
Copper layers (1*16): Top 0.035mm / dielectric 1.5mm / Bottom 0.035mm
Design rules "SparkFun_Derived_GoldePheonix_10mil": minimum track width 10mil, minimum drill 15mil, track to track 8mil, track to pad 8mil, pad to pad 8mil, via to via 8mil, smd to smd 8mil, copper to edge 10mil, drill to drill 8mil, minimum pad ring 12mil, minimum via ring 10mil, stop-mask expansion 4mil, vias tented up to drill 18mil, thermal gap 10mil

### Footprints (pad centres in the part's own frame; a part is rotated, then mirrored left to right if it is on the bottom)
6P-SMD-3.5 = smd 1.27 x 2.286: COM1 2.413,3.937; L -4.318,-3.937; R -0.635,3.937; RS -5.334,3.937 | smd 1.27 x 2.794: COM2 2.286,-3.683 | smd 1.27 x 3.302: LS -6.35,-3.429 | hole 1.27: -5.588,0
0603 = smd 1 x 1: 1 -0.8,0; 2 0.8,0
0805 = smd 1.2 x 1.4: 1 -1,0; 2 1,0
SO16 = smd 0.66 x 2.032: 1 -4.445,-3.073; 2 -3.175,-3.073; 3 -1.905,-3.073; 4 -0.635,-3.073; 5 0.635,-3.073; 6 1.905,-3.073; 7 3.175,-3.073; 8 4.445,-3.073; 9 4.445,3.073; 10 3.175,3.073; 11 1.905,3.073; 12 0.635,3.073; 13 -0.635,3.073; 14 -1.905,3.073; 15 -3.175,3.073; 16 -4.445,3.073
M09HP = drill 1.016 octagon: 1 -5.486,1.27; 2 -2.743,1.27; 3 0,1.27; 4 2.743,1.27; 5 5.486,1.27; 6 -4.115,-1.27; 7 -1.372,-1.27; 8 1.372,-1.27; 9 4.115,-1.27 | drill 3.302 pad 5.08: G1 -12.522,0; G2 12.522,0
CHIPLED_0603 = smd 0.8 x 0.8: A 0,-0.75; C 0,0.75
PS/2 = drill 0.9: 1 -1.3,0; 2 1.3,0; 3 -3.4,0; 4 3.4,0; 5 -3.4,-2.5; 6 3.4,-2.5 | drill 0.8 long: GND1 -6.75,3; GND2 6.75,3; GND3 0,3.8
POWER_NO_TEXT = drill 0.8 square: P1 0,3.81 | drill 0.8 octagon: P2 0,1.27; P3 0,-1.27; P4 0,-3.81
EVQ-Q2 = smd 3.2 x 1.2: A -3.4,-2; A' 3.4,-2; B -3.4,2; B' 3.4,2
MICROSD = smd 0.7 x 1.5: 1 9,-10.64; 2 7.9,-10.24; 3 6.8,-10.64; 4 5.7,-11.04; 5 4.6,-10.64; 6 3.5,-11.04; 7 2.4,-10.64; 8 1.3,-10.64 | smd 1.8 x 1.4: CD1 2,-0.44; CD2 8,-0.44 | smd 1.4 x 1.9: MT1 0.4,-13.54; MT2 13.6,-14.44
AMEGA_SHIELD_NOANALOG = drill 1 pad 1.422: 3.3V 35.56,2.54; 5V@0 38.1,2.54; 5V@1 93.98,50.8; 5V@2 96.52,50.8; AREF 23.876,50.8; D2 58.42,50.8; D3 55.88,50.8; D4 53.34,50.8; D5 50.8,50.8; D6 48.26,50.8; D7 45.72,50.8; D8 41.656,50.8; D9 39.116,50.8; D10 36.576,50.8; D11 34.036,50.8; D12 31.496,50.8; D13 28.956,50.8; D14 68.58,50.8; D15 71.12,50.8; D16 73.66,50.8; D17 76.2,50.8; D18 78.74,50.8; D19 81.28,50.8; D20 83.82,50.8; D21 86.36,50.8; D22 93.98,48.26; D23 96.52,48.26; D24 93.98,45.72; D25 96.52,45.72; D26 93.98,43.18; D27 96.52,43.18; D28 93.98,40.64; D29 96.52,40.64; D30 93.98,38.1; D31 96.52,38.1; D32 93.98,35.56; D33 96.52,35.56; D34 93.98,33.02; D35 96.52,33.02; D36 93.98,30.48; D37 96.52,30.48; D38 93.98,27.94; D39 96.52,27.94; D40 93.98,25.4; D41 96.52,25.4; D42 93.98,22.86; D43 96.52,22.86; D44 93.98,20.32; D45 96.52,20.32; D46 93.98,17.78; D47 96.52,17.78; D48 93.98,15.24; D49 96.52,15.24; D50 93.98,12.7; D51 96.52,12.7; D52 93.98,10.16; D53 96.52,10.16; GND@0 40.64,2.54; GND@1 43.18,2.54; GND@2 26.416,50.8; GND@3 93.98,7.62; GND@4 96.52,7.62; RES 33.02,2.54; RX 63.5,50.8; TX 60.96,50.8; VIN 100.33,73.66
STAND-OFF-TIGHT = hole 3.048: 0,0
HDF15H = drill 0.9 octagon: 1 4.329,2.54 | drill 0.9: 2 2.043,2.54; 3 -0.243,2.54; 4 -2.529,2.54; 5 -4.815,2.54; 6 5.472,0; 7 3.186,0; 8 0.9,0; 9 -1.386,0; 10 -3.672,0; 11 4.329,-2.54; 12 2.043,-2.54; 13 -0.243,-2.54; 14 -2.529,-2.54; 15 -4.815,-2.54 | drill 3 pad 5: P$1 -12.5,0; P$2 12.5,0

### Placement (x,y rotation side)
AJ1  4.57,17.91 180 top
AJ2  115.44,17.53 0 top
C1  16,20.7 0 top
C2  16,18.67 0 top
C3  21.59,27.81 180 top
C4  28.7,27.81 0 top
C5  33.02,27.81 0 top
C6  36.83,21.46 0 top
C7  36.83,18.92 0 top
C8  103,23.24 0 top
C9  103,25.78 0 top
IC1  29.21,21.46 180 top
JS1  11.43,39.24 270 top
JS2  107.95,38.86 90 top
LED1  106.3,20.57 270 top
LED2  106.3,18.03 270 top
LED3  106.3,15.49 270 top
LED4  106.3,12.95 270 top
LOGO1  88.52,33.4 0 top
PS2_A  33.02,37.21 0 top
PS2_B  109.86,8 180 top
PWR_1  99.06,35.94 180 top
PWR_2  99.06,15.62 180 top
R1  28.96,49.15 270 top
R2  31.5,49.15 270 top
R3  34.04,49.15 270 top
R4  36.58,49.15 270 top
R5  39.12,49.15 270 top
R6  41.66,49.15 270 top
R7  45.72,49.15 270 top
R8  48.26,49.15 270 top
R9  48.26,41.66 180 top
R10  67.18,43.56 90 top
R11  74.17,43.56 270 top
R12  101.98,49.91 0 top
R13  101.98,47.37 0 top
R14  101.98,44.83 0 top
R15  101.98,42.29 0 top
R16  101.98,39.75 0 top
R17  62.23,35.94 180 top
R18  77.47,38.48 90 top
R19  101.98,37.21 0 top
R20  101.98,34.67 0 top
R21  101.98,32.13 0 top
R22  16,22.73 0 top
R23  50.04,21.97 90 top
R24  56.39,21.97 90 top
R25  58.93,21.97 90 top
R26  103.12,20.57 180 top
R27  103.12,18.03 180 top
R28  16,16.38 0 top
R29  61.47,16.38 270 top
R30  63.5,16.38 270 top
R31  65.91,16.38 270 top
R32  67.56,16.38 270 top
R33  69.22,16.38 270 top
R34  70.87,16.38 270 top
R35  72.64,16.38 270 top
R36  74.3,16.38 270 top
R37  75.95,16.38 270 top
R38  77.6,16.38 270 top
R39  79.5,16.38 270 top
R40  81.28,16.38 270 top
R41  83.06,16.38 270 top
R42  84.84,16.38 270 top
R43  103.12,15.49 180 top
R44  103.12,12.95 180 top
R45  99.69,22.61 180 top
R46  99.69,25.15 180 top
R47  98.93,7.87 270 top
R48  114.43,12.95 0 top
S1  60.96,43.56 180 top
S2  80.26,45.09 0 top
S3  50.8,37.21 180 top
S4  60.96,30.86 0 top
S5  71.12,37.21 180 top
SD1  45.72,18.16 0 top
SP1  15.88,9.27 0 top
U1  0,1.65 0 top
U$1  [STAND-OFF-TIGHT]  90.17,54.99 0 top
U$2  [STAND-OFF-TIGHT]  19.05,54.99 0 top
U$3  [STAND-OFF-TIGHT]  40.64,13.08 0 top
X1  76.2,9.27 0 top

### Tracks (layer width: path | path; a pad name or v marks a point on that pad's centre or on a via)
3V3
  Top 0.254: IC1.16 35.3,18.39 C7.1
  Top 0.406: R25.2 R24.2 R23.2
  pour Top: 0,1.52 95.25,1.52 95.25,57.53 0,57.53
5V0
  Top 0.61: PS2_A.4 38.1,37.21 39.37,35.94 39.37,28.32 41.91,25.78 41.91,19.43 36.83,14.35 36.83,8 38.1,6.73 U1.5V@0
5V0_PS2
  Bottom 0.61: PS2_B.4 101.6,13.49 101.6,18.16 100.33,19.43 PWR_2.P4
AUDIO1-LEFT  (via drill 0.38)
  Top 0.254: v19.3,22.73 R22.2
  Bottom 0.254: U1.D28 89.15,42.29 56.39,9.53 37.08,9.53 23.88,22.73 v19.3,22.73
AUDIO1-RIGHT  (via drill 0.38)
  Top 0.254: v19.05,16.38 R28.2
  Bottom 0.254: U1.D30 88.39,39.75 56.64,8 36.07,8 27.69,16.38 v19.05,16.38
AUDIO2-LEFT
  Top 0.254: U1.D45 98.26,21.97 R45.2
AUDIO2-RIGHT
  Top 0.254: U1.D43 98.26,24.51 R46.2
BLUE
  Top 0.254: X1.3 75.96,13.32 74.93,14.35 71.12,14.35 71.12,15.33 R34.2 R33.2 R32.2 R31.2
BLUE1
  Top 0.254: R31.1 65.91,20.57 77.47,32.13 85.09,32.13 91.44,38.48 91.44,42.29 U1.D26
BLUE2
  Top 0.254: R32.1 67.56,20.95 77.47,30.86 87.63,30.86 U1.D32
BLUE3
  Top 0.254: R33.1 69.22,21.34 77.47,29.59 88.9,29.59 U1.D34
BLUE4
  Top 0.254: R34.1 70.87,21.72 77.47,28.32 90.17,28.32 U1.D36
DTE_CTS
  Top 0.254: SP1.8 17.25,5.69 16.26,4.7 8.64,4.7 6.6,6.73 6.6,11.05 7.87,12.32 11.43,12.32 13.46,14.35 19.3,14.35 21.34,16.38 21.34,21.11 IC1.8
DTE_RTS
  Top 0.254: SP1.7 14.5,6.5 13.97,5.97 10.16,5.97 7.87,8.26 7.87,10.79 8.89,11.81 11.94,11.81 13.21,13.08 19.3,13.08 22.61,16.38 22.61,19.43 26.04,22.86 IC1.7
DTE_RX
  Top 0.254: SP1.2 13.13,11.48 13.97,12.32 19.56,12.32 23.37,16.13 28.96,16.13 29.84,17.02 IC1.13
DTE_TX
  Top 0.254: SP1.3 15.88,10.41 17.02,9.27 22.1,9.27 23.62,10.79 23.62,12.06 26.67,15.11 29.72,15.11 31.11,16.51 IC1.14
GND  (via drill 0.38)
  Top 0.254: C1.2 C2.2 v18.29,18.67 | R18.1 79.54,37.68 v80.01,37.21 | C3.2 v18.54,27.81 | IC1.15 32.38,16.26 v32.51,16.13 | C6.2 v39.62,21.46 39.62,19.18 39.37,18.92 C7.2 | 45.69,4.19 SD1.MT1 | SD1.MT2 47.02,3.72 SD1.MT1 | SD1.6 49.22,6.17 47.75,4.7 46.2,4.7 SD1.MT1 | R9.1 49.91,41.66 v50.93,42.67 | R10.1 68.8,42.76 v68.96,42.93 | R11.1 75.09,44.36 v75.82,45.09 | R17.1 64.39,35.94 v64.64,36.2
  Top 0.406: AJ1.COM2 2.29,14.1 AJ1.COM1 2.16,10.46 SP1.G1
  Top 0.61: 45.69,4.19 U1.GND@1
  Bottom 0.254: v18.54,27.81 18.54,28.32 | v32.51,16.13 32.77,16.13 | v39.62,21.46 39.62,21.21 | v50.93,42.67 50.93,42.42 50.8,42.29 | v68.96,42.93 68.96,43.31 | v75.82,45.09 76.07,45.09 | v64.64,36.2 64.64,36.45
  pour Bottom: 0,1.52 95.25,1.52 95.25,57.53 0,57.53
GREEN
  Top 0.254: X1.2 78.24,14.94 R38.2 R37.2 R36.2 R35.2
GREEN1
  Top 0.254: R35.1 72.64,22.23 77.47,27.05 91.44,27.05 U1.D38
GREEN2
  Top 0.254: R36.1 74.3,22.61 77.47,25.78 92.71,25.78 U1.D40
GREEN3
  Top 0.254: U1.D42 78.74,24.51 75.95,21.72 R37.1
GREEN4
  Top 0.254: U1.D44 87.63,21.97 86.36,23.24 80.01,23.24 77.6,20.83 R38.1
HORIZONTAL_SYNC
  Top 0.254: R29.1 61.47,18.67 77.47,34.67 85.09,34.67 88.9,38.48 88.9,44.83 U1.D22
JOY_3V3
  pour Top: 95.25,57.53 119.38,57.53 119.38,1.65 95.25,1.65
JOY_GND  (via drill 0.38)
  Top 0.254: LED1.C LED2.C LED3.C LED4.C 107.05,12.18 106.68,11.81 PWR_2.P1 | C9.2 103.8,27.09 v104.01,27.3
  Top 0.406: C9.2 C8.2 | AJ2.COM1 117.86,13.97 AJ2.COM2 117.73,11.84 PS2_B.3
  Bottom 0.254: v104.01,27.3 104.14,27.3 104.27,27.43
  pour Bottom: 95.25,57.53 119.38,57.53 119.38,1.65 95.25,1.65
JS1_1
  Top 0.254: U1.D13 R1.1
  Bottom 0.254: JS1.1 21.23,44.73 U1.D13
JS1_2
  Top 0.254: U1.D11 R3.1
  Bottom 0.254: JS1.2 20.78,41.99 28.96,50.17 31.75,50.17 U1.D11
JS1_3
  Top 0.254: U1.D9 R5.1
  Bottom 0.254: JS1.3 20.57,39.24 29.72,48.39 35.05,48.39 U1.D9
JS1_4
  Top 0.254: U1.D8 R6.1
  Bottom 0.254: JS1.4 18.85,36.5 29.97,47.62 36.83,47.62 U1.D8
JS1_5
  Top 0.254: U1.D6 R8.1
  Bottom 0.254: JS1.5 25.3,33.76 26.67,32.39 40.39,32.39 46.23,38.23 46.23,50.42 U1.D6
JS1_6
  Top 0.254: U1.D12 R2.1
  Bottom 0.254: JS1.6 20.88,43.36 28.7,51.18 30.23,51.18 U1.D12
JS1_7
  Top 0.254: R4.1 U1.D10
  Bottom 0.254: JS1.7 20.68,40.62 29.46,49.4 33.53,49.4 U1.D10
JS1_9
  Top 0.254: U1.D7 R7.1
  Bottom 0.254: JS1.9 18.49,35.13 30.23,46.86 40.13,46.86 U1.D7
JS2_1
  Top 0.254: U1.D31 97.79,38.48 99.91,38.48 R16.1
  Bottom 0.254: JS2.1 106.68,33.4 101.6,38.48 97.79,38.48 U1.D31
JS2_2
  Top 0.254: U1.D29 R15.1
  Bottom 0.254: JS2.2 106.5,36.12 101.6,41.02 97.79,41.02 U1.D29
JS2_3
  Top 0.254: U1.D27 R14.1
  Bottom 0.254: JS2.3 106.3,38.86 101.6,43.56 97.79,43.56 U1.D27
JS2_4
  Top 0.254: U1.D25 R13.1
  Bottom 0.254: JS2.4 106.1,41.61 100.33,47.37 U1.D25
JS2_5
  Top 0.254: U1.D23 R12.1
  Bottom 0.254: JS2.5 105.89,44.35 100.33,49.91 U1.D23
JS2_6
  Top 0.254: U1.D33 97.79,35.94 99.91,35.94 R19.1
  Bottom 0.254: JS2.6 109.22,33.15 107.7,31.62 105.92,31.62 101.6,35.94 97.79,35.94 U1.D33
JS2_7
  Top 0.254: U1.D35 97.79,33.4 99.91,33.4 R20.1
  Bottom 0.254: JS2.7 110.21,37.49 111.76,35.94 111.76,32.13 110.49,30.86 104.14,30.86 101.6,33.4 97.79,33.4 U1.D35
JS2_9
  Top 0.254: U1.D37 97.79,30.86 99.31,30.86 99.91,30.86 | 99.91,30.86 R21.1 | JS2.9 109.8,42.98 113.03,39.75 113.03,32.13 111.76,30.86 99.91,30.86
LED1
  Top 0.254: R26.2 97.66,20.57 U1.D47
LED2
  Top 0.254: R27.2 97.66,18.03 U1.D49
LED3
  Top 0.254: R43.2 97.66,15.49 U1.D51
LED4
  Top 0.254: R44.2 97.66,12.95 U1.D53
N$1
  Top 0.254: R45.1 101.56,22.61 C8.1 102.2,22.64 102.87,21.97 107.19,21.97 108.58,20.57 108.58,20.19 109.47,19.3 111.25,19.3 111.89,18.67 111.89,14.35 AJ2.L
N$2
  Top 0.254: C1.1 R22.1 15.24,22.01 15.24,28.32 12.7,30.86 10.16,30.86 7.62,28.32 7.62,24.51 8.89,23.24 AJ1.L
N$3
  Top 0.254: R44.1 LED4.A
N$4
  Top 0.254: X1.13 75.96,3.95 74.93,2.92 68.58,2.92 67.31,4.19 67.31,11.01 R29.2
N$5
  Top 0.254: X1.14 73.67,5.47 72.39,4.19 69.85,4.19 68.58,5.46 68.58,11.77 R30.2
N$6
  Top 0.254: IC1.2 32.38,22.1 33.02,21.46 C6.1
N$7
  Top 0.254: IC1.6 27.3,25.65 25.15,27.81 C3.1
N$8
  Top 0.254: IC1.1 33.66,27.45 C5.2
N$9
  Top 0.254: R43.1 LED3.A
N$10
  Top 0.254: R27.1 LED2.A
N$11
  Top 0.254: R26.1 LED1.A
N$12
  Top 0.254: IC1.4 29.84,27.67 C4.2
N$13
  Top 0.254: IC1.3 31.11,26.91 C5.1
N$14
  Top 0.254: IC1.5 28.57,25.91 27.94,26.54 27.94,27.57 C4.1
N$15
  Top 0.254: R46.1 101.56,25.15 C9.1 102.2,28.28 103.76,29.84 110.24,29.84 114.81,25.27 AJ2.R
N$16
  Top 0.254: R47.2 105.19,7.07 105.92,6.35 110.14,6.35 PS2_B.1
N$17
  Top 0.254: PS2_B.5 113.89,11.62 R48.2
N$34
  Top 0.254: R28.1 C2.1 13.97,16.89 13.21,16.13 8.13,16.13 5.97,13.97 AJ1.R
PS2CLK1
  Top 0.254: U1.D5 50.8,48.64 49.02,46.86 35.05,46.86 27.94,39.75 27.94,36.39 PS2_A.5
PS2CLK2  (via drill 0.38)
  Top 0.254: R48.1 113.63,14.95 v114.3,15.62
  Bottom 0.254: v114.3,15.62 114.3,18.16 110.49,21.97 104.14,21.97 U1.D39
PS2DAT1
  Top 0.254: U1.D4 53.34,49.91 49.53,46.1 35.56,46.1 30.48,41.02 30.48,38.45 PS2_A.1
PS2DAT2  (via drill 0.38)
  Top 0.254: v98.17,10.16 98.17,9.44 R47.1
  Bottom 0.254: U1.D41 97.79,25.78 97.79,10.54 v98.17,10.16
RED
  Top 0.254: X1.1 80.53,14.83 R40.2 | R39.2 R40.2 | R40.2 R41.2 R42.2
RED1
  Top 0.254: U1.D52 91.44,11.81 86.07,17.18 R42.1
RED2
  Top 0.254: U1.D50 90.17,14.35 85.09,19.43 83.82,19.43 83.06,18.67 R41.1
RED3
  Top 0.254: U1.D48 88.9,16.89 85.09,20.7 82.55,20.7 81.28,19.43 R40.1
RED4
  Top 0.254: U1.D46 87.63,19.43 85.09,21.97 81.28,21.97 79.5,20.19 R39.1
RESET
  Top 0.254: 81.28,43.09 S2.A 76.54,42.76 R11.2 | 81.28,43.09 S2.A' | U1.D19 81.28,43.09
RX  (via drill 0.38)
  Top 0.254: U1.RX 59.44,48.39 54.61,48.39 49.78,43.56 44.96,43.56 43.18,41.78 v43.18,29.59 | IC1.12 28.57,20.32 28.96,20.7 v30.73,20.7
  Bottom 0.254: v43.18,29.59 43.18,29.34 34.54,20.7 v30.73,20.7
SD_!CS  (via drill 0.38)
  Top 0.254: v60.96,20.95 58.94,20.95 R25.1
  Top 0.406: SD1.2 53.62,11.58 58.93,16.89 R25.1
  Bottom 0.254: U1.D16 73.66,33.66 v60.96,20.95
SD_CD  (via drill 0.38)
  Top 0.254: v47.75,20.45 47.75,17.75 SD1.CD1
  Bottom 0.254: U1.D3 55.88,45.59 47.5,37.21 47.5,20.7 v47.75,20.45
SD_MISO  (via drill 0.38)
  Top 0.254: v48.51,25.02 48.51,21.46 49.02,20.95 50.02,20.95 R23.1
  Top 0.406: SD1.7 48.12,13.7 50.04,15.62 R23.1
  Bottom 0.254: U1.D2 58.42,45.85 50.04,37.47 50.04,26.54 v48.51,25.02
SD_MOSI  (via drill 0.38)
  Top 0.254: v54.36,21.21 56.15,21.21 R24.1
  Top 0.406: SD1.3 52.52,11.75 56.39,15.62 R24.1
  Bottom 0.254: U1.D14 54.36,38.23 v54.36,21.21
SD_SCK  (via drill 0.38)
  Top 0.254: SD1.5 50.32,12.86 v50.55,13.08
  Bottom 0.254: U1.D15 71.12,33.66 v50.55,13.08
SW_DOWN
  Top 0.254: 61.43,34.16 R17.2 61.43,37.3 62.1,37.97 63.63,37.97 66.67,41.02 85.09,41.02 86.36,42.29 86.36,48.64 83.82,51.18 U1.D20 | 61.43,34.16 61.43,31.79 S4.A' S4.A | 61.56,34.29 61.43,34.16
SW_LEFT
  Top 0.254: U1.D17 76.2,51.18 74.93,49.91 63.5,49.91 60.96,47.37 55.88,47.37 54.61,46.1 54.61,39.62 S3.A S3.A' 47.4,41.6 R9.2
SW_RIGHT
  Top 0.254: S5.A' S5.A 77.4,39.21 R18.2 85.89,39.28 87.63,41.02 87.63,48.64 86.36,49.91 U1.D21
SW_UP
  Top 0.254: S1.A' S1.A 65.56,44.36 R10.2 67.31,44.49 67.31,47.37 68.58,48.64 77.47,48.64 78.74,49.91 U1.D18
TX  (via drill 0.38)
  Top 0.254: U1.TX 60.96,51.94 58.67,49.66 54.36,49.66 49.02,44.32 43.69,44.32 41.15,41.78 v41.15,30.86 | IC1.11 27.3,21.59 v27.94,22.23
  Bottom 0.254: v41.15,30.86 32.51,22.23 v27.94,22.23
VERTICAL_SYNC
  Top 0.254: R30.1 63.5,19.43 77.47,33.4 85.09,33.4 90.17,38.48 90.17,43.56 U1.D24

### Text on the board
Top: TODO: Switches | TODO: Mounting holes
Dimension: V-Score | V-Score
tPlace: JOYSTICK 1 | RESET | UP | Joystick 2 | PS/2 A | LEFT | RIGHT | Papilio Platform | Computing Shield V1.0 | DOWN | (c) GadgetFactory LLC | www.papilio.cc BPS6001 | VGA | AUDIO 1 | Serial Port | SD Card | AUDIO 2 | PS/2 B